# EAGLE design Apollo4-BluePlus-Module_rev_b_v6 (EAGLE 9.7.0)
AUTHOR: Pat Pannuto; REV: B; TITLE: Apollo4-BluePlus-Module

## Sheet 1 of 2: Apollo4 IC
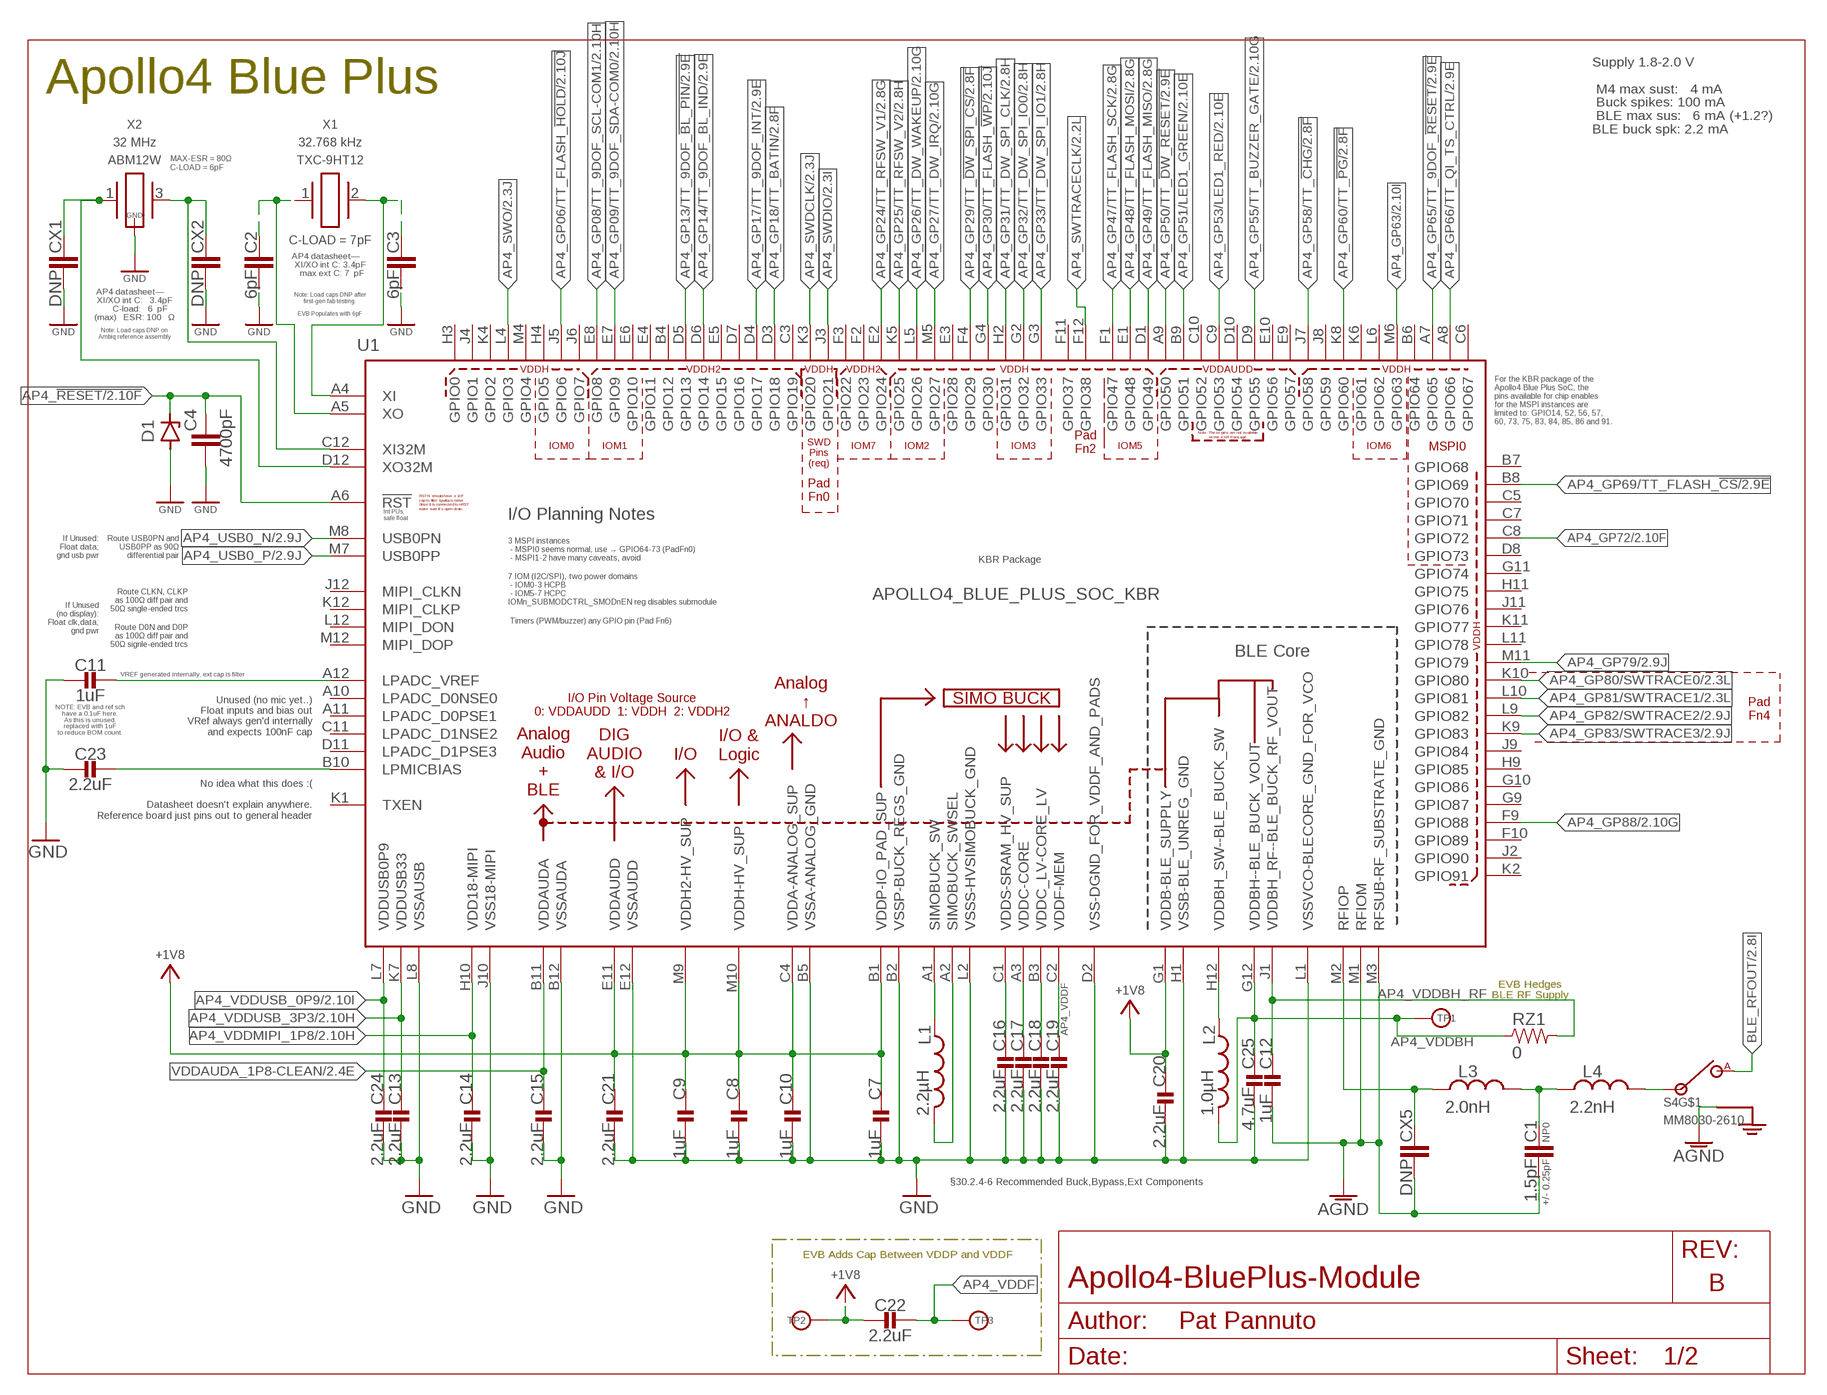
[diagram p0: schematic, sheet 1]

### Parts
C1  1.5pF  C_CHIP-0402(1005-METRIC)  [CAPC1005X60]
C2  6pF  C_CHIP-0402(1005-METRIC)  [CAPC1005X60]
C3  6pF  C_CHIP-0402(1005-METRIC)  [CAPC1005X60]
C4  4700pF  C_CHIP-0402(1005-METRIC)  [CAPC1005X60]
C7  1uF  CAPACITOR0201_CAP  [0201_CAP]
C8  1uF  CAPACITOR0201_CAP  [0201_CAP]
C9  1uF  CAPACITOR0201_CAP  [0201_CAP]
C10  1uF  CAPACITOR0201_CAP  [0201_CAP]
C11  1uF  CAPACITOR0201_CAP  [0201_CAP]
C12  1uF  CAPACITOR0201_CAP  [0201_CAP]
C13  2.2uF  CAPACITOR0201_CAP  [0201_CAP]
C14  2.2uF  CAPACITOR0201_CAP  [0201_CAP]
C15  2.2uF  CAPACITOR0201_CAP  [0201_CAP]
C16  2.2uF  CAPACITOR0201_CAP  [0201_CAP]
C17  2.2uF  CAPACITOR0201_CAP  [0201_CAP]
C18  2.2uF  CAPACITOR0201_CAP  [0201_CAP]
C19  2.2uF  CAPACITOR0201_CAP  [0201_CAP]
C20  2.2uF  CAPACITOR0201_CAP  [0201_CAP]
C21  2.2uF  CAPACITOR0201_CAP  [0201_CAP]
C22  2.2uF  CAPACITOR0201_CAP  [0201_CAP]
C23  2.2uF  CAPACITOR0201_CAP  [0201_CAP]
C24  2.2uF  CAPACITOR0201_CAP  [0201_CAP]
C25  4.7uF  CAPACITOR0402_CAP  [0402_CAP]
CX1  DNP  C_CHIP-0402(1005-METRIC)  [CAPC1005X60]
CX2  DNP  C_CHIP-0402(1005-METRIC)  [CAPC1005X60]
CX5  DNP  C_CHIP-0402(1005-METRIC)  [CAPC1005X60]
D1  ZENER  ZENER_SODFL(1608-METRIC)  [SODFL1608X70]
L1  2.2µH  INDUCTOR0805  [0805_CAP]
L2  1.0µH  INDUCTOR0603  [0603_CAP]
L3  2.0nH  L_CHIP-0402(1006-METRIC)  [INDC1006X60N]
L4  2.2nH  L_CHIP-0402(1006-METRIC)  [INDC1006X60N]
RZ1  0  RESISTOR0402_RES  [0402_RES]
S4  MM8030-2610  [MM8030-2610]
TP1  VDDBH  TEST-POINT  [PAD.03X.03]
TP2  VDDP  TEST-POINT  [PAD.03X.03]
TP3  VDDF  TEST-POINT  [PAD.03X.03]
U1  APOLLO4_BLUE_PLUS_SOC_KBR  [APOLLO4_BLUE_SOC_BGA]
X1  TXC-9HT12  [TXC-9HT12]
X2  ABM12W  [ABM12W]

### Nets
+1V8: C7.P$1 C8.P$1 C9.P$1 C10.P$1 C20.P$1 C21.P$1 C22.P$2 TP2.P$1(TESTPOINT) U1.B1(VDDP-IO_PAD_SUP) U1.C4(VDDA-ANALOG_SUP) U1.E11(VDDAUDD) U1.G1(VDDB-BLE_SUPPLY) U1.M9(VDDH2-HV_SUP) U1.M10(VDDH-HV_SUP) ; also sheet 2
AGND: C1.2 C12.P$2 CX5.2 S4.G1(GND) S4.G2(GND) U1.M1(RFIOM) U1.M3(RFSUB-RF_SUBSTRATE_GND) ; also sheet 2
AP4_!RESET: C4.1 D1.1(C) U1.A6(!RST) ; also sheet 2
AP4_GP06/TT_FLASH_!HOLD: U1.J5(GPIO6) ; also sheet 2
AP4_GP08/TT_9DOF_SCL-COM1: U1.E8(GPIO8) ; also sheet 2
AP4_GP09/TT_9DOF_SDA-COM0: U1.E7(GPIO9) ; also sheet 2
AP4_GP13/TT_9DOF_!BL_PIN: U1.D5(GPIO13) ; also sheet 2
AP4_GP14/TT_9DOF_BL_IND: U1.D6(GPIO14) ; also sheet 2
AP4_GP17/TT_9DOF_INT: U1.D4(GPIO17) ; also sheet 2
AP4_GP18/TT_BATIN: U1.D3(GPIO18) ; also sheet 2
AP4_GP24/TT_RFSW_V1: U1.E2(GPIO24) ; also sheet 2
AP4_GP25/TT_RFSW_V2: U1.K5(GPIO25) ; also sheet 2
AP4_GP26/TT_DW_WAKEUP: U1.L5(GPIO26) ; also sheet 2
AP4_GP27/TT_DW_IRQ: U1.M5(GPIO27) ; also sheet 2
AP4_GP29/TT_!DW_SPI_CS: U1.F4(GPIO29) ; also sheet 2
AP4_GP30/TT_FLASH_!WP: U1.G4(GPIO30) ; also sheet 2
AP4_GP31/TT_DW_SPI_CLK: U1.H2(GPIO31) ; also sheet 2
AP4_GP32/TT_DW_SPI_IO0: U1.G2(GPIO32) ; also sheet 2
AP4_GP33/TT_DW_SPI_IO1: U1.G3(GPIO33) ; also sheet 2
AP4_GP47/TT_FLASH_SCK: U1.F1(GPIO47) ; also sheet 2
AP4_GP48/TT_FLASH_MOSI: U1.E1(GPIO48) ; also sheet 2
AP4_GP49/TT_FLASH_MISO: U1.D1(GPIO49) ; also sheet 2
AP4_GP50/TT_!DW_RESET: U1.A9(GPIO50) ; also sheet 2
AP4_GP51/LED1_GREEN: U1.B9(GPIO51) ; also sheet 2
AP4_GP53/LED1_RED: U1.C9(GPIO53) ; also sheet 2
AP4_GP55/TT_BUZZER_GATE: U1.D9(GPIO55) ; also sheet 2
AP4_GP58/TT_!CHG: U1.J7(GPIO58) ; also sheet 2
AP4_GP60/TT_!PG: U1.K8(GPIO60) ; also sheet 2
AP4_GP63: U1.M6(GPIO63) ; also sheet 2
AP4_GP65/TT_9DOF_!RESET: U1.A7(GPIO65) ; also sheet 2
AP4_GP66/TT_QI_TS_CTRL: U1.A8(GPIO66) ; also sheet 2
AP4_GP69/TT_FLASH_!CS: U1.B8(GPIO69) ; also sheet 2
AP4_GP72: U1.C8(GPIO72) ; also sheet 2
AP4_GP79: U1.M11(GPIO79) ; also sheet 2
AP4_GP80/SWTRACE0: U1.K10(GPIO80) ; also sheet 2
AP4_GP81/SWTRACE1: U1.L10(GPIO81) ; also sheet 2
AP4_GP82/SWTRACE2: U1.L9(GPIO82) ; also sheet 2
AP4_GP83/SWTRACE3: U1.K9(GPIO83) ; also sheet 2
AP4_GP88: U1.F9(GPIO88) ; also sheet 2
AP4_LPADC_VREF: C11.P$2 U1.A12(LPADC_VREF)
AP4_LPMICBIAS: C23.P$2 U1.B10(LPMICBIAS)
AP4_RFIOP [BLE_PHY]: CX5.1 L3.1 U1.M2(RFIOP)
AP4_SWDCLK: U1.K3(GPIO20) ; also sheet 2
AP4_SWDIO: U1.J3(GPIO21) ; also sheet 2
AP4_SWO: U1.L4(GPIO3) ; also sheet 2
AP4_SWTRACECLK: U1.F12(GPIO38) ; also sheet 2
AP4_USB0_N [USB_PHY]: U1.M8(USB0PN) ; also sheet 2
AP4_USB0_P [USB_PHY]: U1.M7(USB0PP) ; also sheet 2
AP4_VDDBH: C25.1 L2.2 RZ1.1 TP1.P$1(TESTPOINT) U1.G12(VDDBH--BLE_BUCK_VOUT)
AP4_VDDBH_RF: C12.P$1 RZ1.2 U1.J1(VDDBH_RF--BLE_BUCK_RF_VOUT)
AP4_VDDBH_SW: L2.1 U1.H12(VDDBH_SW--BLE_BUCK_SW)
AP4_VDDC: C17.P$1 U1.A3(VDDC-CORE)
AP4_VDDC_LV: C18.P$1 U1.B3(VDDC_LV-CORE_LV)
AP4_VDDF: C19.P$1 C22.P$1 TP3.P$1(TESTPOINT) U1.C2(VDDF-MEM)
AP4_VDDMIPI_1P8: C14.P$1 U1.H10(VDD18-MIPI) ; also sheet 2
AP4_VDDS: C16.P$1 U1.C1(VDDS-SRAM_HV_SUP)
AP4_VDDUSB_0P9: C24.P$1 U1.L7(VDDUSB0P9) ; also sheet 2
AP4_VDDUSB_3P3: C13.P$1 U1.K7(VDDUSB33) ; also sheet 2
AP4_XI: C3.1 U1.A4(XI) X1.2
AP4_XI32M: CX2.1 U1.C12(XI32M) X2.3
AP4_XO: C2.1 U1.A5(XO) X1.1
AP4_XO32M: CX1.1 U1.D12(XO32M) X2.1
BLE_RFOUT [BLE_PHY]: S4.OUT(A) ; also sheet 2
GND: C2.2 C3.2 C4.2 C7.P$2 C8.P$2 C9.P$2 C10.P$2 C11.P$1 C13.P$2 C14.P$2 C15.P$2 C16.P$2 C17.P$2 C18.P$2 C19.P$2 C20.P$2 C21.P$2 C23.P$1 C24.P$2 C25.2 CX1.2 CX2.2 D1.2(A) U1.B2(VSSP-BUCK_REGS_GND) U1.B5(VSSA-ANALOG_GND) U1.B12(VSSAUDA) U1.D2(VSS-DGND_FOR_VDDF_AND_PADS) U1.E12(VSSAUDD) U1.H1(VSSB-BLE_UNREG_GND) U1.J10(VSS18-MIPI) U1.L1(VSSVCO-BLECORE_GND_FOR_VCO) U1.L2(VSSS-HVSIMOBUCK_GND) U1.L8(VSSAUSB) X2.2(GND) X2.4(GND) ; also sheet 2
N$17 [BLE_PHY]: C1.1 L3.2 L4.1
N$18 [BLE_PHY]: L4.2 S4.IN
SIMOBUCK_SW: L1.P$1 U1.A1(SIMOBUCK_SW)
SIMOBUCK_SWSEL: L1.P$2 U1.A2(SIMOBUCK_SWSEL)
VDDAUDA_1P8-CLEAN: C15.P$1 U1.B11(VDDAUDA) ; also sheet 2
Unconnected: U1.A10(LPADC_D0NSE0) U1.A11(LPADC_D0PSE1) U1.B4(GPIO12) U1.B6(GPIO64) U1.B7(GPIO68) U1.C3(GPIO19) U1.C5(GPIO70) U1.C6(GPIO67) U1.C7(GPIO71) U1.C10(GPIO52) U1.C11(LPADC_D1NSE2) U1.D7(GPIO16) U1.D8(GPIO73) U1.D10(GPIO54) U1.D11(LPADC_D1PSE3) U1.E3(GPIO28) U1.E4(GPIO11) U1.E5(GPIO15) U1.E6(GPIO10) U1.E9(GPIO57) U1.E10(GPIO56) U1.F2(GPIO23) U1.F3(GPIO22) U1.F10(GPIO89) U1.F11(GPIO37) U1.G9(GPIO87) U1.G10(GPIO86) U1.G11(GPIO74) U1.H3(GPIO0) U1.H4(GPIO5) U1.H9(GPIO85) U1.H11(GPIO75) U1.J2(GPIO90) U1.J4(GPIO1) U1.J6(GPIO7) U1.J8(GPIO59) U1.J9(GPIO84) U1.J11(GPIO76) U1.J12(MIPI_CLKN) U1.K1(TXEN) U1.K2(GPIO91) U1.K4(GPIO2) U1.K6(GPIO61) U1.K11(GPIO77) U1.K12(MIPI_CLKP) U1.L6(GPIO62) U1.L11(GPIO78) U1.L12(MIPI_DON) U1.M4(GPIO4) U1.M12(MIPI_DOP)

### Notes on the sheet
- Apollo4 Blue Plus
- Supply 1.8-2.0 V
  
   M4 max sust:   4 mA
   Buck spikes: 100 mA
   BLE max sus:   6 mA (+1.2?)
  BLE buck spk: 2.2 mA
- AP4 datasheet—    
  XI/XO int C: 3.4pF
    max ext C: 7  pF
- AP4 datasheet—    
  XI/XO int C:   3.4pF
       C-load:   6  pF
  (max)   ESR: 100   Ω
- Note: Load caps DNP after
  first-gen fab testing.
  
  EVB Populates with 6pF
- Note: Load caps DNP on
  Ambiq reference assembly
- For the KBR package of the
  Apollo4 Blue Plus SoC, the
  pins available for chip enables
  for the MSPI instances are
  limited to: GPIO14, 52, 56, 57,
  60, 73, 75, 83, 84, 85, 86 and 91.
- Pad
  Fn2
- MSPI0
- IOM0 | IOM1 | IOM7 | IOM2 | IOM3 | IOM5 | IOM6
- SWD
  Pins
  (req)
- Pad
  Fn0
- Int PUs,
  safe float
- I/O Planning Notes
- 3 MSPI instances
   - MSPI0 seems normal, use → GPIO64-73 (PadFn0)
   - MSPI1-2 have many caveats, avoid
- If Unused:
  Float data;
  gnd usb pwr
- Route USB0PN and
  USB0PP as 90Ω
  differential pair
- KBR Package
- 7 IOM (I2C/SPI), two power domains
   - IOM0-3 HCPB
   - IOM5-7 HCPC
  IOMn_SUBMODCTRL_SMODnEN reg disables submodule
- Route CLKN, CLKP
  as 100Ω diff pair and
  50Ω single-ended trcs
- If Unused
  (no display):
  Float clk,data;
  gnd pwr
- Timers (PWM/buzzer) any GPIO pin (Pad Fn6)
- Route D0N and D0P
  as 100Ω diff pair and
  50Ω signle-ended trcs
- VREF generated internally, ext cap is filter
- NOTE: EVB and ref sch
  have a 0.1uF here.
  As this is unused,
  replaced with 1uF
  to reduce BOM count.
- Pad
  Fn4
- Unused (no mic yet..)
  Float inputs and bias out
  VRef always gen'd internally
  and expects 100nF cap
- No idea what this does :(
  
  Datasheet doesn't explain anywhere.
  Reference board just pins out to general header
- EVB Hedges
  BLE RF Supply
- §30.2.4-6 Recommended Buck,Bypass,Ext Components
- EVB Adds Cap Between VDDP and VDDF

## Sheet 2 of 2: Support Circuits
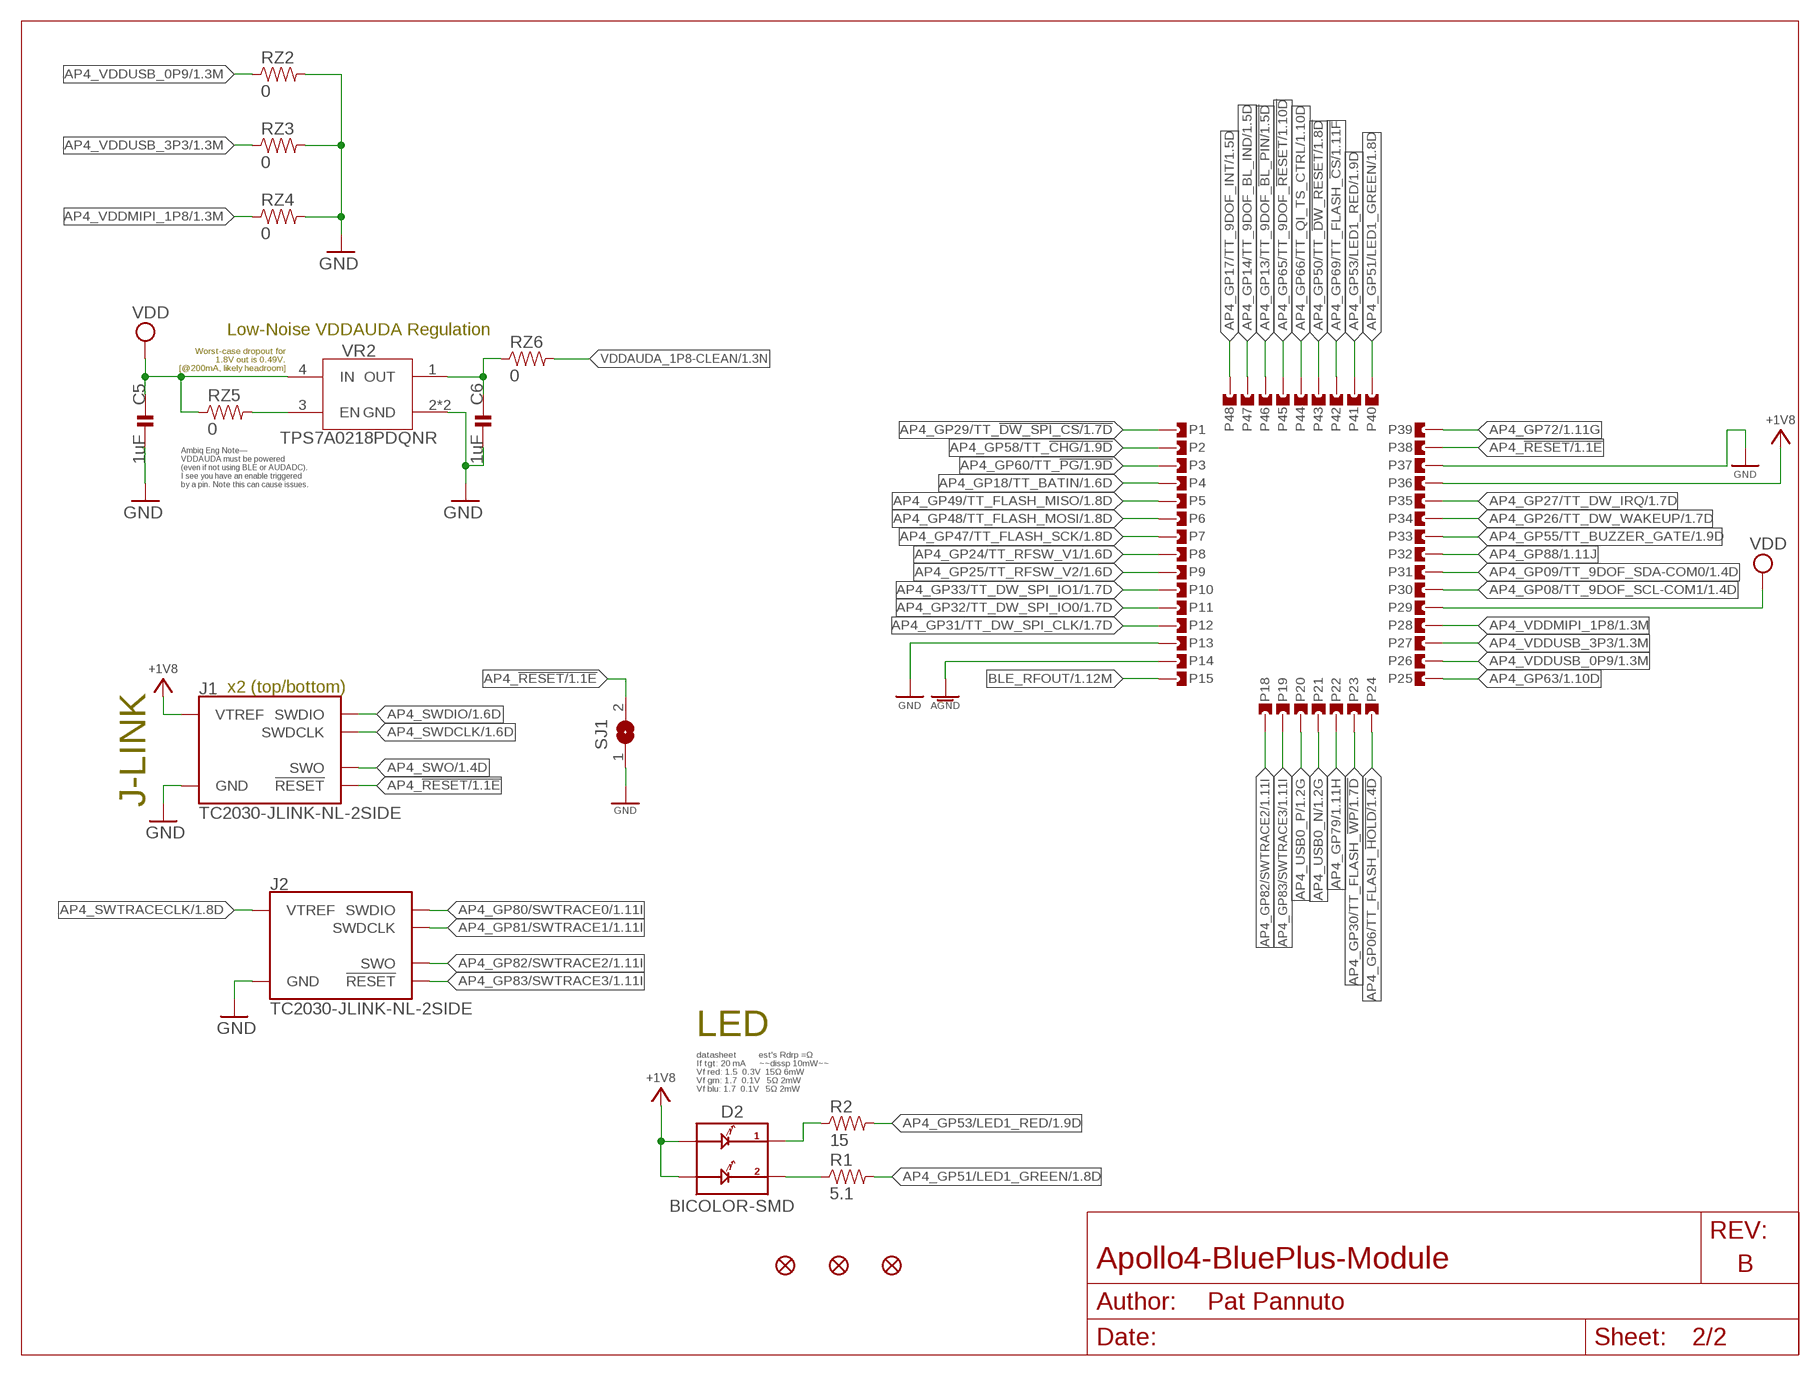
[diagram p1: schematic, sheet 2]

### Parts
C5  1uF  CAPACITOR0201_CAP  [0201_CAP]
C6  1uF  CAPACITOR0201_CAP  [0201_CAP]
D2  BICOLOR-SMD  [LED-0606]
FD1  FIDUCIALUFIDUCIAL  [FIDUCIAL-MICRO]
FD2  FIDUCIALUFIDUCIAL  [FIDUCIAL-MICRO]
FD3  FIDUCIALUFIDUCIAL  [FIDUCIAL-MICRO]
J1  TC2030-JLINK-NL-2SIDE  [TC2030-IDC-NL-2SIDE]
J2  TC2030-JLINK-NL-2SIDE  [TC2030-IDC-NL-2SIDE]
P1  CASTELLATION4L  [CASTELLATION-0.55MM_DRILL-4L]
P2  CASTELLATION4L  [CASTELLATION-0.55MM_DRILL-4L]
P3  CASTELLATION4L  [CASTELLATION-0.55MM_DRILL-4L]
P4  CASTELLATION4L  [CASTELLATION-0.55MM_DRILL-4L]
P5  CASTELLATION4L  [CASTELLATION-0.55MM_DRILL-4L]
P6  CASTELLATION4L  [CASTELLATION-0.55MM_DRILL-4L]
P7  CASTELLATION4L  [CASTELLATION-0.55MM_DRILL-4L]
P8  CASTELLATION4L  [CASTELLATION-0.55MM_DRILL-4L]
P9  CASTELLATION4L  [CASTELLATION-0.55MM_DRILL-4L]
P10  CASTELLATION4L  [CASTELLATION-0.55MM_DRILL-4L]
P11  CASTELLATION4L  [CASTELLATION-0.55MM_DRILL-4L]
P12  CASTELLATION4L  [CASTELLATION-0.55MM_DRILL-4L]
P13  CASTELLATION4L  [CASTELLATION-0.55MM_DRILL-4L]
P14  CASTELLATION4L  [CASTELLATION-0.55MM_DRILL-4L]
P15  CASTELLATION4L  [CASTELLATION-0.55MM_DRILL-4L]
P18  CASTELLATION4L  [CASTELLATION-0.55MM_DRILL-4L]
P19  CASTELLATION4L  [CASTELLATION-0.55MM_DRILL-4L]
P20  CASTELLATION4L  [CASTELLATION-0.55MM_DRILL-4L]
P21  CASTELLATION4L  [CASTELLATION-0.55MM_DRILL-4L]
P22  CASTELLATION4L  [CASTELLATION-0.55MM_DRILL-4L]
P23  CASTELLATION4L  [CASTELLATION-0.55MM_DRILL-4L]
P24  CASTELLATION4L  [CASTELLATION-0.55MM_DRILL-4L]
P25  CASTELLATION4L  [CASTELLATION-0.55MM_DRILL-4L]
P26  CASTELLATION4L  [CASTELLATION-0.55MM_DRILL-4L]
P27  CASTELLATION4L  [CASTELLATION-0.55MM_DRILL-4L]
P28  CASTELLATION4L  [CASTELLATION-0.55MM_DRILL-4L]
P29  CASTELLATION4L  [CASTELLATION-0.55MM_DRILL-4L]
P30  CASTELLATION4L  [CASTELLATION-0.55MM_DRILL-4L]
P31  CASTELLATION4L  [CASTELLATION-0.55MM_DRILL-4L]
P32  CASTELLATION4L  [CASTELLATION-0.55MM_DRILL-4L]
P33  CASTELLATION4L  [CASTELLATION-0.55MM_DRILL-4L]
P34  CASTELLATION4L  [CASTELLATION-0.55MM_DRILL-4L]
P35  CASTELLATION4L  [CASTELLATION-0.55MM_DRILL-4L]
P36  CASTELLATION4L  [CASTELLATION-0.55MM_DRILL-4L]
P37  CASTELLATION4L  [CASTELLATION-0.55MM_DRILL-4L]
P38  CASTELLATION4L  [CASTELLATION-0.55MM_DRILL-4L]
P39  CASTELLATION4L  [CASTELLATION-0.55MM_DRILL-4L]
P40  CASTELLATION4L  [CASTELLATION-0.55MM_DRILL-4L]
P41  CASTELLATION4L  [CASTELLATION-0.55MM_DRILL-4L]
P42  CASTELLATION4L  [CASTELLATION-0.55MM_DRILL-4L]
P43  CASTELLATION4L  [CASTELLATION-0.55MM_DRILL-4L]
P44  CASTELLATION4L  [CASTELLATION-0.55MM_DRILL-4L]
P45  CASTELLATION4L  [CASTELLATION-0.55MM_DRILL-4L]
P46  CASTELLATION4L  [CASTELLATION-0.55MM_DRILL-4L]
P47  CASTELLATION4L  [CASTELLATION-0.55MM_DRILL-4L]
P48  CASTELLATION4L  [CASTELLATION-0.55MM_DRILL-4L]
R1  5.1  RESISTOR0201_RES  [0201_RES]
R2  15  RESISTOR0201_RES  [0201_RES]
RZ2  0  RESISTOR0402_RES  [0402_RES]
RZ3  0  RESISTOR0402_RES  [0402_RES]
RZ4  0  RESISTOR0402_RES  [0402_RES]
RZ5  0  RESISTOR0402_RES  [0402_RES]
RZ6  0  RESISTOR0402_RES  [0402_RES]
SJ1  SJ  [SJ]
VR2  TPS7A0218PDQNR  [4-XDFN-EP]

### Nets
+1V8: D2.A1 D2.A2 J1.1(VTREF) J1.B1(VTREF) P36.P$1 P36.P$2 P36.P$3 ; also sheet 1
AGND: P14.P$1 P14.P$2 P14.P$3 ; also sheet 1
AP4_!RESET: J1.3(!RESET) J1.B3(!RESET) P38.P$1 P38.P$2 P38.P$3 SJ1.2 ; also sheet 1
AP4_GP06/TT_FLASH_!HOLD: P24.P$1 P24.P$2 P24.P$3 ; also sheet 1
AP4_GP08/TT_9DOF_SCL-COM1: P30.P$1 P30.P$2 P30.P$3 ; also sheet 1
AP4_GP09/TT_9DOF_SDA-COM0: P31.P$1 P31.P$2 P31.P$3 ; also sheet 1
AP4_GP13/TT_9DOF_!BL_PIN: P46.P$1 P46.P$2 P46.P$3 ; also sheet 1
AP4_GP14/TT_9DOF_BL_IND: P47.P$1 P47.P$2 P47.P$3 ; also sheet 1
AP4_GP17/TT_9DOF_INT: P48.P$1 P48.P$2 P48.P$3 ; also sheet 1
AP4_GP18/TT_BATIN: P4.P$1 P4.P$2 P4.P$3 ; also sheet 1
AP4_GP24/TT_RFSW_V1: P8.P$1 P8.P$2 P8.P$3 ; also sheet 1
AP4_GP25/TT_RFSW_V2: P9.P$1 P9.P$2 P9.P$3 ; also sheet 1
AP4_GP26/TT_DW_WAKEUP: P34.P$1 P34.P$2 P34.P$3 ; also sheet 1
AP4_GP27/TT_DW_IRQ: P35.P$1 P35.P$2 P35.P$3 ; also sheet 1
AP4_GP29/TT_!DW_SPI_CS: P1.P$1 P1.P$2 P1.P$3 ; also sheet 1
AP4_GP30/TT_FLASH_!WP: P23.P$1 P23.P$2 P23.P$3 ; also sheet 1
AP4_GP31/TT_DW_SPI_CLK: P12.P$1 P12.P$2 P12.P$3 ; also sheet 1
AP4_GP32/TT_DW_SPI_IO0: P11.P$1 P11.P$2 P11.P$3 ; also sheet 1
AP4_GP33/TT_DW_SPI_IO1: P10.P$1 P10.P$2 P10.P$3 ; also sheet 1
AP4_GP47/TT_FLASH_SCK: P7.P$1 P7.P$2 P7.P$3 ; also sheet 1
AP4_GP48/TT_FLASH_MOSI: P6.P$1 P6.P$2 P6.P$3 ; also sheet 1
AP4_GP49/TT_FLASH_MISO: P5.P$1 P5.P$2 P5.P$3 ; also sheet 1
AP4_GP50/TT_!DW_RESET: P43.P$1 P43.P$2 P43.P$3 ; also sheet 1
AP4_GP51/LED1_GREEN: P40.P$1 P40.P$2 P40.P$3 R1.2 ; also sheet 1
AP4_GP53/LED1_RED: P41.P$1 P41.P$2 P41.P$3 R2.2 ; also sheet 1
AP4_GP55/TT_BUZZER_GATE: P33.P$1 P33.P$2 P33.P$3 ; also sheet 1
AP4_GP58/TT_!CHG: P2.P$1 P2.P$2 P2.P$3 ; also sheet 1
AP4_GP60/TT_!PG: P3.P$1 P3.P$2 P3.P$3 ; also sheet 1
AP4_GP63: P25.P$1 P25.P$2 P25.P$3 ; also sheet 1
AP4_GP65/TT_9DOF_!RESET: P45.P$1 P45.P$2 P45.P$3 ; also sheet 1
AP4_GP66/TT_QI_TS_CTRL: P44.P$1 P44.P$2 P44.P$3 ; also sheet 1
AP4_GP69/TT_FLASH_!CS: P42.P$1 P42.P$2 P42.P$3 ; also sheet 1
AP4_GP72: P39.P$1 P39.P$2 P39.P$3 ; also sheet 1
AP4_GP79: P22.P$1 P22.P$2 P22.P$3 ; also sheet 1
AP4_GP80/SWTRACE0: J2.2(SWDIO) J2.B2(SWDIO) ; also sheet 1
AP4_GP81/SWTRACE1: J2.4(SWDCLK) J2.B4(SWDCLK) ; also sheet 1
AP4_GP82/SWTRACE2: J2.6(SWO) J2.B6(SWO) P18.P$1 P18.P$2 P18.P$3 ; also sheet 1
AP4_GP83/SWTRACE3: J2.3(!RESET) J2.B3(!RESET) P19.P$1 P19.P$2 P19.P$3 ; also sheet 1
AP4_GP88: P32.P$1 P32.P$2 P32.P$3 ; also sheet 1
AP4_LED2_BLUE_COMM: D2.C1 R2.1
AP4_LED_RED_COMM: D2.C2 R1.1
AP4_SWDCLK: J1.4(SWDCLK) J1.B4(SWDCLK) ; also sheet 1
AP4_SWDIO: J1.2(SWDIO) J1.B2(SWDIO) ; also sheet 1
AP4_SWO: J1.6(SWO) J1.B6(SWO) ; also sheet 1
AP4_SWTRACECLK: J2.1(VTREF) J2.B1(VTREF) ; also sheet 1
AP4_USB0_N [USB_PHY]: P21.P$1 P21.P$2 P21.P$3 ; also sheet 1
AP4_USB0_P [USB_PHY]: P20.P$1 P20.P$2 P20.P$3 ; also sheet 1
AP4_VDDMIPI_1P8: P28.P$1 P28.P$2 P28.P$3 RZ4.1 ; also sheet 1
AP4_VDDUSB_0P9: P26.P$1 P26.P$2 P26.P$3 RZ2.1 ; also sheet 1
AP4_VDDUSB_3P3: P27.P$1 P27.P$2 P27.P$3 RZ3.1 ; also sheet 1
BLE_RFOUT [BLE_PHY]: P15.P$1 P15.P$2 P15.P$3 ; also sheet 1
GND: C5.P$2 C6.P$2 J1.5(GND) J1.B5(GND) J2.5(GND) J2.B5(GND) P13.P$1 P13.P$2 P13.P$3 P37.P$1 P37.P$2 P37.P$3 RZ2.2 RZ3.2 RZ4.2 SJ1.1 VR2.2(GND) VR2.PAD(GND) ; also sheet 1
VDD: C5.P$1 P29.P$1 P29.P$2 P29.P$3 RZ5.1 VR2.4(IN)
VDDAUDA_1P8-CLEAN: RZ6.2 ; also sheet 1
VR2_EN: RZ5.2 VR2.3(EN)
VR2_OUT: C6.P$1 RZ6.1 VR2.1(OUT)

### Notes on the sheet
- Low-Noise VDDAUDA Regulation
- Worst-case dropout for
  1.8V out is 0.49V.
  [@200mA, likely headroom]
- Ambiq Eng Note—
  VDDAUDA must be powered
  (even if not using BLE or AUDADC).
  I see you have an enable triggered
  by a pin. Note this can cause issues.
- x2 (top/bottom)
- J-LINK
- LED
- datasheet          est's Rdrp =Ω
  If tgt: 20 mA      ~~dissp 10mW~~
  Vf red: 1.5  0.3V  15Ω 6mW
  Vf grn: 1.7  0.1V   5Ω 2mW
  Vf blu: 1.7  0.1V   5Ω 2mW

## Library data of the parts
C1 = Capacitor:C: Capacitor - Generic; CATEGORY: Capacitor; DESCRIPTION: CAP CER 1.5PF 50V C0G/NP0 0402; MANUFACTURER: KEMET; MPN: C0402C159C5GAC7867; TEMPCOEFF: NP0; TOLERANCE: +/- 0.25pF
C2 C3 = Capacitor:C: Capacitor - Generic; CATEGORY: Capacitor; MANUFACTURER: Murata; MPN: GCM1555C1H6R0BA16D
C4 = Capacitor:C: Capacitor - Generic; CATEGORY: Capacitor; MPN: KGM05AR71E472KH
C5-C10 C12 = passives:CAPACITOR: SMD Capacitor; MANUFACTURER: Murata; MPN: GRM033R61A105ME44D
C11 = passives:CAPACITOR: SMD Capacitor; MANUFACTURER: MURATA; MPN: GRM033R61A105ME44D
C13-C24 = passives:CAPACITOR: SMD Capacitor; MANUFACTURER: Murata; MPN: GRM033R61A225KE47D
C25 = passives:CAPACITOR: SMD Capacitor; MPN: CL05A475MP5NRNC
CX1 CX2 CX5 = Capacitor:C: Capacitor - Generic; CATEGORY: Capacitor
D1 = Diode:ZENER: Zener Diode - Generic; CATEGORY: Diode; DESCRIPTION: DIODE TVS 5.5V STANDOFF 8V BREAKDOWN SC79; MANUFACTURER: NXP SEMICONDUCTOR; MPN: PESD5V0X1UB,135; SUB-CATEGORY: Zener
D2 = leds:BICOLOR-SMD; MPN: MCL0606FRD1GR1T
FD1-FD3 = SparkFun-Aesthetics:FIDUCIAL: Fiducial Alignment Points Point-of-reference for pick-and-place machines and other optical instruments.
J1 J2 = connector:TC2030-JLINK
L1 = passives:INDUCTOR: A very specific inductor; MANUFACTURER: Murata; MPN: DFE201210U-2R2M=P2
L2 = passives:INDUCTOR: A very specific inductor; MANUFACTURER: Murata; MPN: DFE18SAN1R0ME0L
L3 = Inductor:L: Inductor Fixed - Generic; CATEGORY: Inductor; DESCRIPTION: FIXED IND 2.0NH0.1NH SMD; MANUFACTURER: Central Technologies; MPN: CTTF0402F-2N0B; SUB-CATEGORY: Fixed; TOLERANCE: +/- 0.1 nH
L4 = Inductor:L: Inductor Fixed - Generic; CATEGORY: Inductor; DESCRIPTION: FIXED IND 2.2NH0.1NH SMD; MANUFACTURER: Central Technologies; MPN: CTTF0402F-2N2B; SUB-CATEGORY: Fixed; TOLERANCE: +/- 0.1 nH
P1-P15 P18-P48 = connector:CASTELLATION: Castellation 0.55 mm drill, 1.27 mm pitch – Matches ESP32
R1 = passives:RESISTOR: Resistor Basic schematic elements and footprints for 0201, 0402, 0603, 1206, and PTH resistors.; MPN: SR731HTTC5R10F; PDISS: 0.002 W
R2 = passives:RESISTOR: Resistor Basic schematic elements and footprints for 0201, 0402, 0603, 1206, and PTH resistors.; DESCRIPTION: RES SMD 15 OHM 5% 1/20W 0201; MPN: ERJ-1GNJ150C; PDISS: 0.006 W
RZ1-RZ6 = passives:RESISTOR: Resistor Basic schematic elements and footprints for 0201, 0402, 0603, 1206, and PTH resistors.; MPN: RMCF0402ZT0R00; SUBSTITUE: Any
S4 = switches:MM8030-2610; DURABILITY: 100 Cycles; FREQ-MAX: 11 GHz; MANUFACTURER: Murata; MPN: MM8030-2610
SJ1 = jumper:SJ: SMD solder JUMPER
TP1-TP3 = headers:TEST-POINT
U1 = Quorvo:APOLLO4_BLUE_PLUS_SOC_KBR; DESCRIPTION: IC - SoC Cortex-M4 and BLE Radio with M0, 4.7x4.7mm 131-pin BGA; MANUFACTURER: Ambiq; MPN: AMA4B2KP-KBR
VR2 = regulators:TPS7A02; MPN: TPS7A0218PDQNR
X1 = crystals:TXC-9HT12; C-LOAD: 7pF; FREQUENCY: 32.768 kHz; MANUFACTURER: TXC Corp; MPN: 9HT12-32.768KDZY-T
X2 = crystals:ABM12W; C-LOAD: 6pF; FREQUENCY: 32 MHz; MANUFACTURER: Abracon; MAX-ESR: 80Ω; MPN: ABM12W-32.0000MHZ-6-D1X-T3

## Net classes
1 USB_PHY: width 0.152 mm, clearance 0.305 mm
2 BLE_PHY: width 0.203 mm, clearance 0.095 mm

## Board
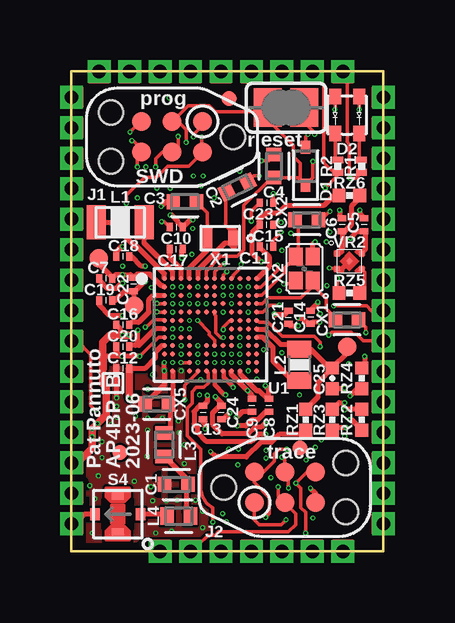
[diagram p2: board, top side]
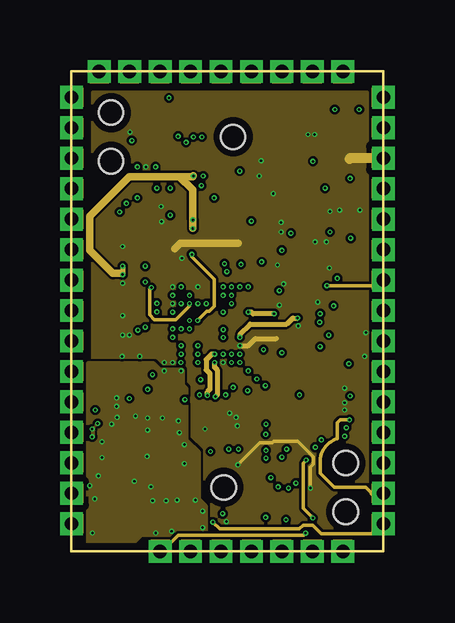
[diagram p3: board, inner layer Route2]
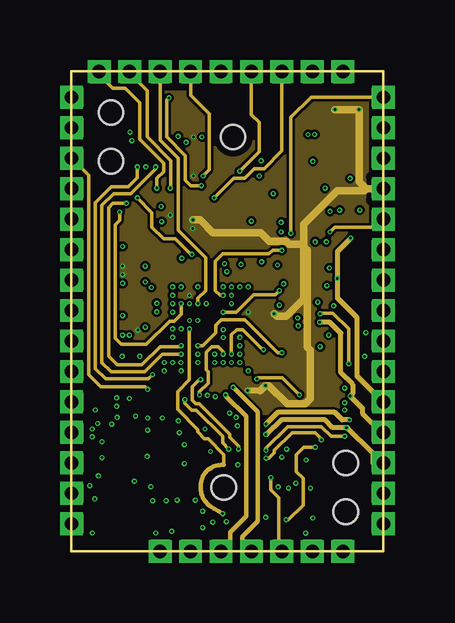
[diagram p4: board, inner layer Route15]
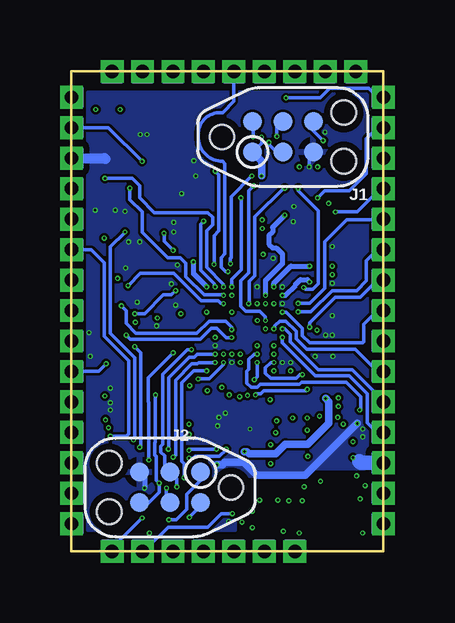
[diagram p5: board, bottom side, seen from below]

Size 13 x 20 mm. Coordinates in mm from the lower left corner, seen from the top.
Outline: 0,0 13,0 13,20 0,20 0,0
Copper layers (1+2*15+16): Top 0.035mm / dielectric 1.5mm / Route2 0.035mm / dielectric 0.15mm / Route15 0.035mm / dielectric 0.2mm / Bottom 0.035mm
Design rules "default *": minimum track width 6mil, minimum drill 4mil, track to track 4mil, track to pad 4mil, pad to pad 4mil, via to via 5mil, smd to smd 4mil, copper to edge 12mil, drill to drill 6mil, minimum pad ring 8mil, minimum via ring 2mil, stop-mask expansion 4mil, vias tented up to drill 0mil, thermal gap 10mil

### Footprints (pad centres in the part's own frame; a part is rotated, then mirrored left to right if it is on the bottom)
CAPC1005X60 = smd 0.56 x 0.629: 1 -0.485,0; 2 0.485,0
0201_CAP = smd 0.25 x 0.35: P$1 -0.275,0; P$2 0.275,0
0402_CAP = smd 0.536 x 0.546: 1 -0.433,0; 2 0.433,0
SODFL1608X70 = smd 0.538 x 0.4: 1 -0.796,0; 2 0.796,0
LED-0606 = smd 0.65 x 0.5: A1 0.775,0.5; A2 0.775,-0.5; C1 -0.775,0.5; C2 -0.775,-0.5
FIDUCIAL-MICRO = smd 0.635 x 0.635: 1 0,0
TC2030-IDC-NL-2SIDE = smd 0.787 x 0.787: 1 -1.27,-0.635; 2 -1.27,0.635; 3 0,-0.635; 4 0,0.635; 5 1.27,-0.635; 6 1.27,0.635 | smd 0.787 x 0.787 bottom: B1 -1.27,0.635; B2 -1.27,-0.635; B3 0,0.635; B4 0,-0.635; B5 1.27,0.635; B6 1.27,-0.635 | hole 1.016: -2.54,0; 2.54,1.016; 2.54,-1.016
0805_CAP = smd 0.8 x 1.4: P$1 1,0; P$2 -1,0
0603_CAP = smd 0.7 x 1: 1 -0.65,0; 2 0.65,0
INDC1006X60N = smd 0.56 x 0.729: 1 -0.485,0; 2 0.485,0
CASTELLATION-0.55MM_DRILL-4L = drill 0.55 pad 0.9 square: P$1 0,0 | smd 0.5 x 0.9: P$2 0.25,0 | smd 0.5 x 0.9 bottom: P$3 0.25,0
0201_RES = smd 0.28 x 0.43: 1 -0.255,0; 2 0.255,0
0402_RES = smd 0.536 x 0.546: 1 -0.433,0; 2 0.433,0
MM8030-2610 = smd 0.4 x 0.5: G1 -0.8,0; G2 0.8,0 | smd 0.5 x 0.4: IN 0,0.95; OUT 0,-0.95
SJ = smd 1.168 x 1.6: 1 -0.762,0; 2 0.762,0
PAD.03X.03 = smd 0.762 x 0.762: P$1 0,0
APOLLO4_BLUE_SOC_BGA = smd 0.2 x 0.2: A1 -1.925,1.925; A2 -1.575,1.925; A3 -1.225,1.925; A4 -0.875,1.925; A5 -0.525,1.925; A6 -0.175,1.925; A7 0.175,1.925; A8 0.525,1.925; A9 0.875,1.925; A10 1.225,1.925; A11 1.575,1.925; A12 1.925,1.925; B1 -1.925,1.575; B2 -1.575,1.575; B3 -1.225,1.575; B4 -0.875,1.575; B5 -0.525,1.575; B6 -0.175,1.575; B7 0.175,1.575; B8 0.525,1.575; B9 0.875,1.575; B10 1.225,1.575; B11 1.575,1.575; B12 1.925,1.575; C1 -1.925,1.225; C2 -1.575,1.225; C3 -1.225,1.225; C4 -0.875,1.225; C5 -0.525,1.225; C6 -0.175,1.225; C7 0.175,1.225; C8 0.525,1.225; C9 0.875,1.225; C10 1.225,1.225; C11 1.575,1.225; C12 1.925,1.225; D1 -1.925,0.875; D2 -1.575,0.875; D3 -1.225,0.875; D4 -0.875,0.875; D5 -0.525,0.875; D6 -0.175,0.875; D7 0.175,0.875; D8 0.525,0.875; D9 0.875,0.875; D10 1.225,0.875; D11 1.575,0.875; D12 1.925,0.875; E1 -1.925,0.525; E2 -1.575,0.525; E3 -1.225,0.525; E4 -0.875,0.525; E5 -0.525,0.525; E6 -0.175,0.525; E7 0.175,0.525; E8 0.525,0.525; E9 0.875,0.525; E10 1.225,0.525; E11 1.575,0.525; E12 1.925,0.525; F1 -1.925,0.175; F2 -1.575,0.175; F3 -1.225,0.175; F4 -0.875,0.175; F9 0.875,0.175; F10 1.225,0.175; F11 1.575,0.175; F12 1.925,0.175; G1 -1.925,-0.175; G2 -1.575,-0.175; G3 -1.225,-0.175; G4 -0.875,-0.175; G9 0.875,-0.175; G10 1.225,-0.175; G11 1.575,-0.175; G12 1.925,-0.175; H1 -1.925,-0.525; H2 -1.575,-0.525; H3 -1.225,-0.525; H4 -0.875,-0.525; H9 0.875,-0.525; H10 1.225,-0.525; H11 1.575,-0.525; H12 1.925,-0.525; J1 -1.925,-0.875; J2 -1.575,-0.875; J3 -1.225,-0.875; J4 -0.875,-0.875; J5 -0.525,-0.875; J6 -0.175,-0.875; J7 0.175,-0.875; J8 0.525,-0.875; J9 0.875,-0.875; J10 1.225,-0.875; J11 1.575,-0.875; J12 1.925,-0.875; K1 -1.925,-1.225; K2 -1.575,-1.225; K3 -1.225,-1.225; K4 -0.875,-1.225; K5 -0.525,-1.225; K6 -0.175,-1.225; K7 0.175,-1.225; K8 0.525,-1.225; K9 0.875,-1.225; K10 1.225,-1.225; K11 1.575,-1.225; K12 1.925,-1.225; L1 -1.925,-1.575; L2 -1.575,-1.575; L4 -0.875,-1.575; L5 -0.525,-1.575; L6 -0.175,-1.575; L7 0.175,-1.575; L8 0.525,-1.575; L9 0.875,-1.575; L10 1.225,-1.575; L11 1.575,-1.575; L12 1.925,-1.575; M1 -1.925,-1.925; M2 -1.575,-1.925; M3 -1.225,-1.925; M4 -0.875,-1.925; M5 -0.525,-1.925; M6 -0.175,-1.925; M7 0.175,-1.925; M8 0.525,-1.925; M9 0.875,-1.925; M10 1.225,-1.925; M11 1.575,-1.925; M12 1.925,-1.925
4-XDFN-EP = smd 0.21 x 0.21: 1 -0.505,0.325; 2 -0.505,-0.325; 3 0.505,-0.325; 4 0.505,0.325 | smd 0.2 x 0.2 rotated 45: PAD 0,0
TXC-9HT12 = smd 0.4 x 0.6: 1 -0.53,0 | smd 0.4 x 0.86: 2 0.53,0
ABM12W = smd 0.73 x 0.58: 1 -0.5,-0.35; 2 0.5,-0.35; 3 0.5,0.35; 4 -0.5,0.35

### Placement (x,y rotation side)
C1  4.37,2.79 180 top
C2  6.91,15.19 26 top
C3  4.72,14.58 180 top
C4  8.43,16.06 90 top
C5  12.19,13.61 90 top
C6  11.28,13.61 90 top
C7  1.42,11.38 180 top
C8  8.23,6.1 270 top
C9  7.52,6.1 270 top
C10  4.37,13.51 180 top
C11  8.13,12.7 180 top
C12  2.13,7.62 180 top
C13  5.49,5.79 270 top
C14  9.96,9.75 90 top
C15  8.13,13.61 0 top
C16  2.13,9.45 180 top
C17  4.37,12.6 0 top
C18  2.13,12.29 180 top
C19  1.42,10.46 180 top
C20  2.13,8.53 180 top
C21  9.04,9.75 270 top
C22  2.59,11.13 90 top
C23  8.13,14.53 180 top
C24  6.25,5.79 270 top
C25  10.87,7.21 270 top
CX1  11.48,9.65 0 top
CX2  9.8,13.82 0 top
CX5  3.56,6.15 180 top
D1  9.75,16.05 90 top
D2  11.48,18.19 90 top
FD1  2.03,4.12 0 top
FD2  9.52,4.31 0 top
FD3  6.57,18.87 0 top
J1  4.19,17.27 180 top
J2  8.89,2.67 0 top
L1  2.03,13.72 180 top
L2  9.5,7.77 90 top
L3  3.86,4.45 270 top
L4  4.47,1.47 180 top
P1  0,18.93 0 top
P2  0,17.66 0 top
P3  0,16.39 0 top
P4  0,15.12 0 top
P5  0,13.85 0 top
P6  0,12.58 0 top
P7  0,11.31 0 top
P8  0,10.04 0 top
P9  0,8.77 0 top
P10  0,7.5 0 top
P11  0,6.23 0 top
P12  0,4.96 0 top
P13  0,3.69 0 top
P14  0,2.42 0 top
P15  0,1.15 0 top
P18  3.69,0 90 top
P19  4.96,0 90 top
P20  6.23,0 90 top
P21  7.5,0 90 top
P22  8.77,0 90 top
P23  10.04,0 90 top
P24  11.31,0 90 top
P25  13,1.15 180 top
P26  13,2.42 180 top
P27  13,3.69 180 top
P28  13,4.96 180 top
P29  13,6.23 180 top
P30  13,7.5 180 top
P31  13,8.77 180 top
P32  13,10.04 180 top
P33  13,11.31 180 top
P34  13,12.58 180 top
P35  13,13.85 180 top
P36  13,15.12 180 top
P37  13,16.39 180 top
P38  13,17.66 180 top
P39  13,18.93 180 top
P40  11.31,20 270 top
P41  10.04,20 270 top
P42  8.77,20 270 top
P43  7.5,20 270 top
P44  6.23,20 270 top
P45  4.96,20 270 top
P46  3.69,20 270 top
P47  2.42,20 270 top
P48  1.15,20 270 top
R1  12.09,16.05 270 top
R2  11.1,16.05 270 top
RZ1  9.75,5.49 270 top
RZ2  12.09,5.49 90 top
RZ3  10.87,5.49 90 top
RZ4  12.09,7.21 90 top
RZ5  11.58,10.77 0 top
RZ6  11.58,14.83 180 top
S4  1.93,1.56 270 top
SJ1  8.94,18.49 180 top
TP1  11.48,8.53 0 top
TP2  1.13,12.23 0 top
TP3  2.62,10.24 0 top
U1  5.79,9.45 0 top
VR2  11.58,12.09 0 top
X1  6.2,13.06 180 top
X2  9.7,11.79 90 top

### Tracks (layer width: path | path; a pad name or v marks a point on that pad's centre or on a via)
+1V8  (via drill 0.1)
  Top 0.152: P36.P$3 P36.P$1 | J1.1 5.46,17.75 5.08,17.37 v5.08,17.27 | D2.A1 10.98,18.42 v10.97,18.41 | D2.A2 11.98,18.42 v11.99,18.41
  Top 0.203: v8.45,9.91 8.5,9.86 8.87,9.86 C21.P$1 | U1.M10 7.02,7.41 7.72,6.71 7.82,6.71 8.15,6.38 8.15,6.37 C8.P$1 8.23,6.76 v8.08,6.91 | U1.M9 6.67,7.38 v7.34,6.7 7.52,6.52 C9.P$1 | U1.B1 3.84,11.05 3.81,11.05 3.79,11.07 3.73,11.07 3.25,11.56 2.75,11.56 C22.P$2 2.46,11.53 v2.13,11.53 1.85,11.53 C7.P$1 1.7,11.43 1.13,12 TP2.P$1 | v5.05,13.82 4.95,13.82 C10.P$1 4.42,13.74 4.42,13.79 4.19,14.01 v4.12,14.01 | v2.77,9.22 2.77,8.69 2.66,8.59 | 2.66,8.59 2.81,8.59 3.49,9.27 U1.G1 | 2.66,8.59 2.46,8.59 C20.P$1
  Route2 0.152: v5.05,13.46 | v2.13,11.53 2.06,11.58
  Route2 0.203: v8.45,9.91 8.44,9.9 7.57,9.9 7.49,9.97 U1.E11 | v2.13,11.89 v2.13,11.53
  Route2 0.305: 4.5,15.62 5.05,15.06 v5.05,13.82 v5.05,13.46 | 4.5,15.62 2.41,15.62 0.76,13.97 0.76,12.55 1.73,11.58 2.06,11.58 | v5.08,15.65 5.05,15.62 4.5,15.62
  Route15 0.254: 7.87,6.7 v7.34,6.7
  Route15 0.305: 9.68,12.42 9.83,12.57 9.83,8.5 9.96,8.38 9.96,6.37 9.73,6.15 8.99,6.15 8.23,6.91 v8.08,6.91 7.87,6.7 | v8.45,9.91 8.55,9.8 8.95,9.8 9.68,10.53 9.68,12.42 | v5.05,13.82 5.36,13.82 5.89,13.28 7.88,13.28 8.23,12.93 8.94,12.93 9.07,12.8 9.68,12.8 | 9.68,12.8 9.68,13.64 11.07,15.04 12.19,15.04 12.28,15.12 | 9.68,12.8 9.68,12.42 | 12.28,15.12 P36.P$1 | 12.28,15.12 11.99,15.41 v11.99,18.41 v10.97,18.41
  Bottom 0.152: P36.P$3 P36.P$1 | v5.08,17.27 5.08,17.02 J1.B1
  Bottom 0.203: U1.C4 4.92,11.28 4.22,11.98 4.22,12.39 4.47,12.65 4.62,12.65 4.78,12.8 4.78,13.16 4.62,13.31 4.62,13.51 v4.12,14.01
  Bottom 0.305: J1.B1 5.08,16.26 v5.08,15.65
  other vias: 4.92,10.67 7.37,9.97
  pour Route15 (rank 6): 3.5,7.99 3.74,7.75 4.64,7.75 4.67,7.74 6.64,5.77 12.32,5.77 12.32,19.13 0.89,19.13 0.89,8 3.47,8
AGND  (via drill 0.1)
  Top 0.152: P14.P$3 P14.P$1
  Top 0.203: C12.P$2 1.86,6.42 v1.88,6.4 | 3.87,7.88 U1.M1 3.87,6.94 CX5.2
  Bottom 0.152: P14.P$3 P14.P$1
  other vias: 3.87,7.52 4.57,7.52 4.45,5.44 3.15,3.96 4.5,4.95 4.7,4.45 4.7,3.66 3.94,2.11 5.16,2.14 5.47,1.68 5.47,1 4.17,0.84 3.51,0.77 0.87,0.77 4.4,2.14 3.38,2.11 0.97,2.19 0.76,2.74 1.12,3.15 1.27,3.91 3.17,5.56 1.27,4.57 1.91,5.59 1.68,5.31 1.88,6.05 3.31,2.7 2.67,5.64 3.78,5.56 3.17,5.05 2.62,2.93
  pour Top: 4.64,7.53 4.59,7.58 3.69,7.58 3.66,7.6 3.42,7.84 0.7,7.84 0.7,0.19 2.4,0.19 2.9,0.68 2.93,0.7 5.91,0.7 5.91,1.59 5.34,2.13 5.33,2.13 5.32,2.14 5.31,2.15 5.31,2.15 5.31,2.15 5.3,2.17 5.3,2.18 5.3,2.19 5.3,2.19 5.3,2.2 5.3,2.22 5.3,2.22 5.3,4.16 4.81,4.67 4.8,4.68 4.8,4.68 4.8,4.68 4.79,4.7 4.79,4.71 4.79,4.71 4.79,4.72 4.79,4.73 4.79,6.77 4.65,6.91 4.64,6.94
  pour Route2: 4.64,7.53 4.59,7.58 3.69,7.58 3.66,7.6 3.42,7.84 0.7,7.84 0.7,0.19 2.4,0.19 2.9,0.68 2.93,0.7 5.6,0.7 5.6,1.89 5.31,2.18 5.3,2.22 5.3,4.13 4.8,4.62 4.79,4.66 4.79,6.77 4.65,6.91 4.64,6.94
AP4_!RESET  (via drill 0.1)
  Top 0.152: U1.A6 5.62,11.68 6.23,12.29 6.91,12.29 7.19,12.57 7.19,14.43 8.33,15.57 C4.1 9.44,15.57 | P38.P$3 P38.P$1 | v4.78,17.04 4.78,17.58 4.45,17.91 J1.3 4.86,18.58 5.73,18.58 5.99,18.33 8.08,18.33 SJ1.2 8.08,18.09 9.25,16.92 9.25,16.46 9.54,16.17 9.54,15.57 9.44,15.57 | 9.44,15.57 D1.1 10.06,15.56 v10.06,16.26
  Bottom 0.152: P38.P$1 P38.P$3 11.46,17.66 v10.06,16.26 | J1.B3 4.45,16.64 4.78,16.97 v4.78,17.04
AP4_GP06/TT_FLASH_!HOLD  (via drill 0.1)
  Top 0.152: P24.P$2 P24.P$1
  Route2 0.152: v9.78,3.81 9.65,3.68 9.65,1.8 v10.06,1.4
  Route15 0.152: U1.J5 5.47,8.57 6.02,9.12 6.02,9.42 6.25,9.65 7.21,9.65 8.59,8.28 v8.76,8.28
  Bottom 0.152: P24.P$1 P24.P$2 11.21,0.25 v10.06,1.4 | v8.76,8.28 9.8,7.24 9.8,6.25 9.78,6.22 v9.78,3.81
  other vias: 5.27,8.57
AP4_GP08/TT_9DOF_SCL-COM1  (via drill 0.1)
  Top 0.152: P30.P$3 P30.P$1
  Route15 0.152: v11.56,7.82 11.56,9.27 10.9,9.93 10.39,9.93 v10.36,9.91 | U1.E8 6.88,9.97 7.59,10.69 8.48,10.69 v8.66,10.87
  Bottom 0.152: P30.P$1 P30.P$3 12.73,7.52 11.86,7.52 v11.56,7.82 | v10.36,9.91 9.96,9.91 9.17,10.69 8.84,10.69 v8.66,10.87
  other vias: 6.32,9.97
AP4_GP09/TT_9DOF_SDA-COM0  (via drill 0.1)
  Top 0.152: v10.72,9.02 10.85,9.14 11.66,9.14 11.76,9.04 11.89,9.04 12.16,8.77 P31.P$3 | U1.E7 5.97,9.87 6.02,9.82 6.02,9.12 6.22,8.91 v6.32,8.91
  Top 0.203: P31.P$3 P31.P$1
  Bottom 0.152: v6.32,8.91 6.55,8.91 6.94,9.3 7.17,9.3 7.63,8.84 10.54,8.84 v10.72,9.02
  Bottom 0.203: P31.P$3 P31.P$1
AP4_GP13/TT_9DOF_!BL_PIN  (via drill 0.1)
  Top 0.152: P46.P$2 P46.P$1
  Route15 0.152: U1.D5 5.27,10.55 5.59,10.87 5.59,12.24 4.45,13.39 4.45,16.38 3.69,17.14 P46.P$1
  Bottom 0.152: P46.P$2 P46.P$1
  other vias: 5.27,10.32
AP4_GP14/TT_9DOF_BL_IND  (via drill 0.1)
  Top 0.152: P47.P$2 P47.P$1
  Route15 0.152: v4.12,15.14 4.14,15.16 4.14,16.28 3.15,17.27 3.15,19.2 2.42,19.93 P47.P$1
  Bottom 0.152: U1.D6 5.59,10.35 5.59,11.25 5.36,11.48 5.36,13.95 4.17,15.14 v4.12,15.14 | P47.P$2 P47.P$1
  other vias: 5.62,10.32
AP4_GP17/TT_9DOF_INT  (via drill 0.1)
  Top 0.152: P48.P$2 P48.P$1
  Route2 0.152: U1.D4 4.92,10.22 4.34,9.65 3.45,9.65 3.25,9.86 3.25,10.92 v3.33,11
  Route15 0.152: v3.56,15.14 3.56,15.54 3.83,15.82 3.83,16.18 2.85,17.17 2.85,18.69 2.23,19.3 1.73,19.3 1.15,19.88 P48.P$1
  Bottom 0.152: v3.33,11 3.25,10.92 2.95,10.92 2.72,11.15 2.72,14.2 3.56,15.04 v3.56,15.14 | P48.P$2 P48.P$1
  other vias: 4.92,10.32
AP4_GP18/TT_BATIN  (via drill 0.1)
  Top 0.152: P4.P$2 P4.P$1
  Route15 0.152: U1.D3 4.57,9.88 4.29,9.6 4.09,9.6 3.12,8.64 2.08,8.64 1.83,8.89 1.83,9.45 1.83,13.61 2.01,13.79 v2.01,14.15
  Bottom 0.152: v2.01,14.15 1.09,14.15 0.25,14.99 P4.P$2 P4.P$1
  other vias: 4.57,10.32
AP4_GP24/TT_RFSW_V1  (via drill 0.1)
  Top 0.152: P8.P$2 P8.P$1
  Bottom 0.152: P8.P$1 P8.P$2 0.81,9.48 0.81,8.74 0.86,8.69 3.07,8.69 3.38,8.99 3.38,9.3 4.06,9.97 U1.E2
  other vias: 4.22,9.97
AP4_GP25/TT_RFSW_V2  (via drill 0.1)
  Top 0.152: P9.P$1 P9.P$2 0.81,8.21 0.81,6.07 v0.99,5.89
  Bottom 0.152: P9.P$2 P9.P$1 | U1.K5 5.39,8.22 5.61,8 5.61,7.59 5.69,7.52 5.69,7.01 5.51,6.83 5.26,6.83 5.13,6.96 3.5,6.96 3.4,7.06 1.55,7.06 0.94,6.45 0.94,5.94 v0.99,5.89
  other vias: 5.27,8.22
AP4_GP26/TT_DW_WAKEUP  (via drill 0.1)
  Top 0.152: P34.P$3 P34.P$1
  Route15 0.152: v5.38,7.16 5.33,7.16 5.03,6.86 5.03,6.3 5.18,6.15 5.33,6.15 6.6,4.88 6.6,4.75 6.96,4.39 v6.96,4.27 | v11.38,4.8 10.82,4.8 10.41,5.21 9.02,5.21 8.1,4.29 v8.1,4.22
  Bottom 0.152: P34.P$1 P34.P$3 12.17,12.58 11.63,12.04 11.63,8.97 10.62,7.95 10.62,4.9 10.72,4.8 v11.38,4.8 | U1.L5 5.27,7.28 v5.38,7.16 | v8.1,4.22 8.05,4.27 v6.96,4.27
  other vias: 5.27,7.87
AP4_GP27/TT_DW_IRQ  (via drill 0.1)
  Top 0.152: P35.P$3 P35.P$1 | U1.M5 5.27,7.47 4.72,6.93 v4.72,6.33
  Route15 0.152: v4.72,6.33 4.72,6.17 5,5.89 5.21,5.89 6.3,4.8 6.3,4.52 v6.55,4.27 | v10.77,13.31 10.97,13.51 12.66,13.51 P35.P$1 | v10.41,4.65 10.39,4.65 10.39,4.72 10.16,4.95 9.2,4.95 8.46,4.22 8.46,4.12 8.23,3.89 v8.1,3.89
  Bottom 0.152: P35.P$3 P35.P$1 | v6.55,4.27 6.55,4.24 6.83,3.96 7.85,3.96 7.92,3.89 v8.1,3.89 | v10.77,13.31 11.38,12.7 11.38,9.09 10.36,8.08 10.36,4.72 10.39,4.7 10.39,4.65 v10.41,4.65
AP4_GP29/TT_!DW_SPI_CS  (via drill 0.1)
  Top 0.152: P1.P$2 P1.P$1
  Route15 0.152: v4.06,18.9 3.96,18.8 3.96,17.27 4.75,16.48 4.75,15.47 4.98,15.24 v5.41,15.24
  Bottom 0.152: U1.F4 4.92,9.78 5.15,10.01 5.74,10.01 5.94,10.21 5.94,11.28 5.61,11.61 5.61,15.04 v5.41,15.24 | v4.06,18.9 2.64,18.9 2.23,19.3 0.62,19.3 P1.P$2 P1.P$1
  other vias: 4.92,9.62
AP4_GP30/TT_FLASH_!WP  (via drill 0.1)
  Top 0.152: P23.P$2 P23.P$1
  Route15 0.152: U1.G4 4.92,7.15 4.42,6.66 4.42,5.92 5.26,5.08 5.26,4.98 5.54,4.7 5.69,4.7 6.35,4.04 6.35,3.61
  Route15 0.178: 6.35,3.61 6.25,3.61 arc90 5.38,2.74 5.38,2.64 arc56 5.79,1.88 arc6 v6.3,1.57
  Bottom 0.152: P23.P$1 P23.P$2 9.73,0.25 8.97,1.02 7.32,1.02 6.76,1.57 v6.3,1.57
  other vias: 4.92,9.27
AP4_GP31/TT_DW_SPI_CLK  (via drill 0.1)
  Top 0.152: P12.P$2 P12.P$1
  Bottom 0.152: U1.H2 4.22,8.7 2.84,7.32 1.42,7.32 0.69,6.58 0.69,5.36 0.29,4.96 P12.P$2 P12.P$1
  other vias: 4.22,8.92
AP4_GP32/TT_DW_SPI_IO0  (via drill 0.1)
  Top 0.152: P11.P$2 P11.P$1
  Bottom 0.152: P11.P$1 P11.P$2 0.25,6.52 1.29,7.57 2.72,7.57 3.89,8.74 3.89,9.04 4.12,9.27 U1.G2
  other vias: 4.22,9.27
AP4_GP33/TT_DW_SPI_IO1  (via drill 0.1)
  Top 0.152: P10.P$2 P10.P$1
  Bottom 0.152: U1.G3 4.52,9.32 4.52,9.4 4.32,9.6 4.07,9.6 3.63,9.17 3.63,8.87 3.2,8.43 1.18,8.43 P10.P$2 P10.P$1
  other vias: 4.57,9.27
AP4_GP47/TT_FLASH_SCK  (via drill 0.1)
  Top 0.152: U1.F1 3.83,9.65 3.43,9.65 3.12,9.35 v3.07,9.35 | P7.P$2 P7.P$1
  Bottom 0.152: v3.07,9.35 3.07,9.53 2.01,10.59 0.97,10.59 P7.P$2 P7.P$1
AP4_GP48/TT_FLASH_MOSI  (via drill 0.1)
  Top 0.152: U1.E1 v3.56,9.97 v3.56,9.98 | P6.P$2 P6.P$1
  Bottom 0.152: v3.56,9.98 3.02,9.98 2.13,10.87 1.12,10.87 0.71,11.28 0.71,12.12 P6.P$2 P6.P$1
AP4_GP49/TT_FLASH_MISO  (via drill 0.1)
  Top 0.152: U1.D1 3.57,10.32 v3.56,10.34 | P5.P$2 P5.P$1
  Bottom 0.152: v3.56,10.34 3.07,10.34 2.44,10.97 2.44,12.9 1.52,13.82 0.28,13.82 P5.P$2 P5.P$1
AP4_GP50/TT_!DW_RESET  (via drill 0.1)
  Top 0.152: U1.A9 6.74,11.45 6.74,11.5 7.06,11.82 v7.06,11.96 | P43.P$2 P43.P$1
  Route15 0.152: v7.01,15.85 7.82,16.66 7.82,17.88 7.5,18.2 P43.P$1
  Bottom 0.152: v7.06,11.96 7.06,13.16 6.86,13.36 6.86,15.7 v7.01,15.85 | P43.P$2 P43.P$1
AP4_GP51/LED1_GREEN  (via drill 0.1)
  Top 0.152: R1.2 11.84,15.54 v11.61,15.54 11.58,15.57 11.58,16.97 11.48,17.07 11.48,19.58 P40.P$2 P40.P$1
  Bottom 0.152: U1.B9 6.67,11.14 7.37,11.84 7.37,13.36 7.11,13.61 7.11,13.92 7.32,14.12 9.55,14.12 10.16,14.73 10.16,15.24 10.46,15.54 v11.61,15.54 | P40.P$2 P40.P$1
  other vias: 6.67,11.02
AP4_GP53/LED1_RED  (via drill 0.1)
  Top 0.152: v10.57,15.14 11.1,15.67 R2.2 10.92,15.8 10.52,16.2 10.52,19.48 10.24,19.75 P41.P$2 P41.P$1
  Bottom 0.152: v10.57,15.14 10.57,14.66 10.06,14.15 10.06,13.31 8.99,12.24 8.46,12.24 8.23,12.01 8.23,11.46 7.47,10.7 6.74,10.7 6.71,10.67 U1.C9 | P41.P$2 P41.P$1
  other vias: 6.67,10.67
AP4_GP55/TT_BUZZER_GATE  (via drill 0.1)
  Top 0.152: P33.P$2 P33.P$1
  Route2 0.152: v10.64,11.07 12.52,11.07 P33.P$2 P33.P$1
  Bottom 0.152: P33.P$2 P33.P$1 | v10.64,11.07 10.13,11.58 8.84,11.58 8.74,11.58 7.59,10.44 6.88,10.44 6.79,10.35 6.69,10.35 U1.D9
  other vias: 6.67,10.32
AP4_GP58/TT_!CHG  (via drill 0.1)
  Top 0.152: U1.J7 5.97,8.8 5.74,9.03 5.74,9.14 v5.26,9.63 | P2.P$2 P2.P$1
  Route2 0.152: v5.26,9.63 5.64,10.01 5.74,10.01 5.94,10.21 5.94,11.35 5.02,12.28 v5.02,12.38
  Route15 0.152: v5.02,12.38 4.98,12.38 4.33,13.03 3.83,13.03 3.35,13.51 3.35,14.12 v2.74,14.73
  Bottom 0.152: v2.74,14.73 2.44,15.04 1.42,15.04 0.71,15.75 0.71,17.2 P2.P$2 P2.P$1
AP4_GP60/TT_!PG  (via drill 0.1)
  Top 0.152: P3.P$2 P3.P$1
  Route15 0.152: U1.K8 6.32,8.32 6.11,8.53 5.84,8.53 5.61,8.31 5.61,7.57 5.69,7.49 5.69,7.01 5.33,6.66 v5.33,6.53 | P3.P$1 0.71,15.68 0.71,7.37 1.22,6.86 3.07,6.86 v3.17,6.76
  Bottom 0.152: P3.P$2 P3.P$1 | v5.33,6.53 5.28,6.58 5.11,6.58 4.98,6.71 3.23,6.71 v3.17,6.76
  other vias: 6.32,8.22
AP4_GP63  (via drill 0.1)
  Top 0.152: P25.P$3 P25.P$1 | U1.M6 5.69,7.45 5.69,7.01 5.51,6.83 5.21,6.83 5.03,6.66 5.03,6.17 4.83,5.97 4.83,4.83 5.38,4.27 5.38,2.74 arc67 5.89,1.83 v5.89,1.22
  Route2 0.152: v5.89,1.22 6.17,0.94 9.5,0.94 9.65,1.09 10.05,1.09 10.4,0.74 12.5,0.74 12.91,1.15 P25.P$1
  Bottom 0.152: P25.P$3 P25.P$1
AP4_GP65/TT_9DOF_!RESET  (via drill 0.1)
  Top 0.152: P45.P$3 P45.P$1 | U1.A7 5.97,11.66 6.3,11.99 v6.38,11.99
  Route15 0.152: v5.49,15.65 5.74,15.9 5.74,18.24 4.98,19 4.96,19.02 P45.P$1
  Bottom 0.152: P45.P$3 P45.P$1 | v6.38,11.99 6.38,12.22 6.35,12.24 6.35,14.78 v5.49,15.65
AP4_GP66/TT_QI_TS_CTRL  (via drill 0.1)
  Top 0.152: P44.P$3 P44.P$1 | U1.A8 6.32,11.5 v6.47,11.66 v6.48,11.66
  Bottom 0.152: P44.P$1 P44.P$3 6.23,18.76 6.71,18.29 6.81,18.29 arc-90 7.72,17.37 7.72,17.27 arc-90 6.71,16.26 6.6,16.15 6.6,12.39 6.76,12.24 6.76,11.84 6.58,11.66 v6.48,11.66
AP4_GP69/TT_FLASH_!CS  (via drill 0.1)
  Top 0.152: P42.P$2 P42.P$1
  Route15 0.152: v5.94,14.73 6.76,15.54 7.21,15.54 7.62,15.95 8.03,15.95 8.77,16.7 P42.P$1
  Bottom 0.152: P42.P$2 P42.P$1 | U1.B8 6.32,11.34 5.92,11.73 5.92,14.71 v5.94,14.73
  other vias: 6.32,11.02
AP4_GP72  (via drill 0.1)
  Top 0.152: P39.P$2 P39.P$1
  Route15 0.152: U1.C8 6.19,10.67 5.99,10.87 5.99,12.09 6.3,12.39 8.23,12.39 8.38,12.55 v8.76,12.55 | v9.14,13.26 9.14,18.09 9.99,18.93 P39.P$1
  Bottom 0.152: P39.P$2 P39.P$1 | v8.76,12.55 9.14,12.93 v9.14,13.26
  other vias: 6.32,10.67
AP4_GP79  (via drill 0.1)
  Top 0.152: P22.P$3 P22.P$1
  Route15 0.152: P22.P$1 8.64,0.13 8.64,2.23 8.31,2.56 v8.31,3.07
  Bottom 0.152: P22.P$3 P22.P$1 | U1.M11 7.91,7.52 8.41,7.03 8.41,3.76 8.31,3.66 v8.31,3.07
  other vias: 7.37,7.52
AP4_GP80/SWTRACE0  (via drill 0.1)
  Top 0.152: v8.09,1.42 8.24,1.57 8.24,2.24 7.62,2.88 J2.2 8,3.3 8.46,3.76 8.46,4.06 8.66,4.27 v8.97,4.27
  Bottom 0.152: U1.K10 7.75,8.22 7.88,8.1 8.08,8.1 8.94,7.24 8.94,4.29 v8.97,4.27 | v8.09,1.42 7.62,1.91 J2.B2
  other vias: 7.02,8.22
AP4_GP81/SWTRACE1  (via drill 0.1)
  Top 0.152: v9.04,2.64 9.04,3.25 8.99,3.3 J2.4 8.89,3.81 v8.76,3.93
  Bottom 0.152: U1.L10 7.7,7.87 7.75,7.82 7.98,7.82 8.66,7.14 8.66,4.01 8.74,3.93 v8.76,3.93 | J2.B4 9.04,2.03 v9.04,2.64
  other vias: 7.02,7.87
AP4_GP82/SWTRACE2  (via drill 0.1)
  Top 0.152: J2.6 9.8,3.3 v9.35,2.85 9.55,2.64 9.55,1.83 9.75,1.63 v9.75,0.76 | P18.P$3 P18.P$1
  Route2 0.152: v9.75,0.76 9.68,0.69 4.45,0.69 3.77,0 P18.P$1
  Route15 0.152: v7.72,7.19 7.77,7.24 8.79,7.24 v9.5,6.53
  Bottom 0.152: U1.L9 6.67,7.79 7.26,7.19 v7.72,7.19 | v9.5,6.53 9.5,4.55 9.53,4.52 9.53,4.01 9.47,3.96 9.47,2.97 v9.35,2.85 9.35,2.46 9.78,2.03 J2.B6 | P18.P$3 P18.P$1
  other vias: 6.67,7.87
AP4_GP83/SWTRACE3  (via drill 0.1)
  Top 0.152: v8.61,2.69 8.61,2.31 J2.3 9.35,1.57 9.35,1.12 9.04,0.81 6.12,0.81 5.99,0.69 5.7,0.69 5.26,0.25 P19.P$3 P19.P$1
  Route15 0.152: U1.K9 6.67,9.03 6.88,9.25 7.14,9.25 7.98,8.41 v8,8.41
  Bottom 0.152: v8,8.41 8.18,8.41 9.2,7.39 9.2,4.47 9.27,4.39 9.27,4.14 9.12,3.99 9.12,3.53 J2.B3 8.61,3.02 v8.61,2.69 | P19.P$3 P19.P$1
  other vias: 6.67,8.22
AP4_GP88  (via drill 0.1)
  Top 0.152: P32.P$2 P32.P$1 12.49,10.04 12.3,10.24 v10.92,10.24 | U1.F9 6.6,9.62 6.33,9.35 v6.33,9.25
  Bottom 0.152: P32.P$2 P32.P$1 | v10.92,10.24 10.72,10.03 10.72,9.5 10.31,9.09 7.77,9.09 7.26,9.6 6.58,9.6 6.33,9.35 v6.33,9.25
AP4_LED2_BLUE_COMM
  Top 0.152: R2.1 10.98,16.43 D2.C1
AP4_LED_RED_COMM
  Top 0.152: R1.1 11.98,16.42 D2.C2
AP4_LPADC_VREF
  Top 0.203: U1.A12 7.74,11.37 8.26,11.89 8.26,12.25 7.85,12.65 C11.P$2
AP4_LPMICBIAS  (via drill 0.1)
  Top 0.152: v7.49,13.77 7.49,14.17 C23.P$2
  Bottom 0.152: U1.B10 7.06,11.07 7.06,11.15 7.62,11.71 7.62,13.64 v7.49,13.77
  other vias: 7.02,11.02
AP4_RFIOP
  Top 0.203: U1.M2 4.22,6.32 CX5.1 4.12,6.07 4.12,5.19 L3.1
AP4_SWDCLK  (via drill 0.1)
  Top 0.152: v4.45,17.3 4.45,16.89 J1.4 3.79,16.64 3.5,16.36 v3.5,16.03
  Route15 0.152: U1.K3 3.78,8.22 3.05,7.49 1.65,7.49 1.27,7.87 1.27,14.43 1.75,14.91 2.46,14.91 3.5,15.95 v3.5,16.03
  Bottom 0.152: J1.B4 4.45,17.65 v4.45,17.3
  other vias: 4.57,8.22
AP4_SWDIO  (via drill 0.1)
  Top 0.152: v5.44,17.27 5.44,16.66 J1.2 4.88,16.05 4.01,16.05 3.56,15.6 3.05,15.6 2.29,14.83 v2.29,14.5
  Route15 0.152: U1.J3 4.53,8.53 3.69,8.53 2.93,7.77 1.91,7.77 1.55,8.13 1.55,14.33 1.73,14.5 v2.29,14.5
  Bottom 0.152: J1.B2 5.44,17.88 v5.44,17.27
  other vias: 4.57,8.57
AP4_SWO  (via drill 0.1)
  Top 0.152: v2.52,17.12 2.56,17.12 2.92,16.76 J1.6 2.74,16.46 v2.74,16.03 | U1.L4 v4.56,7.87
  Route15 0.152: v3.38,7.37 3.2,7.19 1.42,7.19 0.99,7.62 0.99,14.53 1.65,15.19 2.36,15.19 2.74,15.57 v2.74,16.03
  Bottom 0.152: v4.56,7.87 4.69,7.87 4.92,7.64 4.92,7.43 4.7,7.21 3.63,7.21 3.48,7.37 v3.38,7.37 | v2.52,17.12 2.92,17.53 J1.B6
AP4_SWTRACECLK  (via drill 0.1)
  Top 0.152: v10.36,8.53 10.36,8.71 10.11,8.97 8.79,8.97 8.21,9.55 7.82,9.55 7.74,9.62 U1.F12 | J2.1 7.62,1.32 7.82,1.12 8.74,1.12 v8.94,1.32
  Route15 0.152: v10.16,4.34 9.68,4.34 9.37,4.04 9.37,3.33 9.65,3.05 9.65,1.93 9.04,1.32 v8.94,1.32
  Bottom 0.152: v10.36,8.53 10.11,8.28 10.11,4.39 v10.16,4.34 | J2.B1 7.62,2.97 8.2,2.39 8.2,1.75 8.64,1.32 v8.94,1.32
AP4_USB0_N  (via drill 0.1)
  Top 0.152: P21.P$2 P21.P$1
  Top 0.178: U1.M8 6.34,7.5 6.34,7.25 6.74,6.86 v6.74,6.84
  Route15 0.178: P21.P$1 7.11,0.39 7.11,0.6 7.76,1.26 7.76,5.82 6.75,6.84 v6.74,6.84
  Bottom 0.152: P21.P$2 P21.P$1
AP4_USB0_P  (via drill 0.1)
  Top 0.152: P20.P$2 P20.P$1
  Top 0.178: U1.M7 5.96,6.94 6.38,6.53 v6.43,6.53
  Route15 0.178: P20.P$1 6.62,0.39 6.62,0.8 7.28,1.46 7.28,5.62 6.43,6.48 v6.43,6.53
  Bottom 0.152: P20.P$2 P20.P$1
AP4_VDDBH
  Top 0.203: U1.G12 7.74,9.25 8.09,9.25 8.71,8.63 9.3,8.63 L2.2 9.97,8.42 10.74,7.65 C25.1 | C25.1 10.26,7.04 10.26,6.43 RZ1.1 | TP1.P$1 11.48,8.26 C25.1
AP4_VDDBH_RF  (via drill 0.1)
  Top 0.203: C12.P$1 3.04,7.62 3.49,8.06 3.49,8.3 3.77,8.58 U1.J1 | RZ1.2 9.58,4.88 8.66,4.88 8.33,4.55 7.9,4.55 7.29,3.94 6.02,3.94 v5.79,4.17
  Top 0.305: v2.41,6.38 C12.P$1
  Bottom 0.305: v5.79,4.17 5.69,4.17 5.59,4.06 4.5,4.06 4.09,4.47 3.15,4.47 2.29,5.33 2.29,6.25 v2.41,6.38
AP4_VDDBH_SW
  Top 0.203: L2.1 9.21,7.12 8.4,7.93 8.4,8.49 7.97,8.92 U1.H12
AP4_VDDC
  Top 0.203: U1.A3 4.57,11.77 4.09,12.24 C17.P$1
AP4_VDDC_LV  (via drill 0.1)
  Top 0.203: v3.07,11.89 2.92,11.89 2.51,12.29 C18.P$1
  Bottom 0.203: U1.B3 4.57,11.18 3.85,11.89 v3.07,11.89
  other vias: 4.57,11.02
AP4_VDDF  (via drill 0.1)
  Top 0.203: C19.P$1 1.83,10.46 2.21,10.85 C22.P$1 | v3.07,11.23 3.02,11.23 2.64,10.85 C22.P$1 | C22.P$1 TP3.P$1
  Bottom 0.203: U1.C2 4.08,10.67 3.66,11.1 3.66,11.13 3.46,11.33 3.17,11.33 v3.07,11.23
  other vias: 4.22,10.67
AP4_VDDMIPI_1P8  (via drill 0.1)
  Top 0.152: P28.P$3 P28.P$1
  Top 0.203: v11.61,6.48 11.91,6.78 RZ4.1 | v9.42,9.73 9.63,9.73 9.88,9.48 C14.P$1 9.98,9.5 9.99,9.5 10.03,9.55 v10.34,9.55
  Route2 0.203: U1.H10 7.02,9.05 7.44,9.47 8.97,9.47 9.22,9.73 v9.42,9.73
  Route15 0.203: P28.P$1 12.92,4.96 12.12,5.77 12.12,5.97 v11.61,6.48 11.71,6.58 11.71,6.96 11.23,7.44 11.23,9.09 10.77,9.55 v10.34,9.55
  Bottom 0.152: P28.P$3 P28.P$1
  other vias: 7.02,8.92
AP4_VDDS
  Top 0.203: U1.C1 3.41,10.67 3.22,10.49 3.22,9.98 2.79,9.55 2.51,9.55 C16.P$1
AP4_VDDUSB_0P9  (via drill 0.1)
  Top 0.152: P26.P$3 P26.P$1
  Top 0.203: v5.99,6.45 6.25,6.2 C24.P$1 6.17,6.07 5.87,5.76 5.87,5.31 6.27,4.9 7.37,4.9 7.65,5.18 7.9,5.18 8.03,5.31 v8.1,5.31 | RZ2.1 12.09,5.08 11.68,5.49 v11.58,5.49
  Route2 0.152: 12.52,2.42 12.27,2.67 10.95,2.67 10.36,3.25 10.36,3.79 arc-70 11.07,4.7 11.07,5.36 11.2,5.49 v11.58,5.49
  Route2 0.203: U1.L7 5.97,7.67 6.09,7.54 6.09,6.55 v5.99,6.45 | P26.P$1 12.52,2.42
  Route15 0.203: v8.1,5.31 8.59,5.79 10.97,5.79 11.28,5.49 v11.58,5.49
  Bottom 0.152: P26.P$3 P26.P$1
  other vias: 5.97,7.87
AP4_VDDUSB_3P3  (via drill 0.1)
  Top 0.152: P27.P$3 P27.P$1
  Top 0.203: v5.66,6.5 5.66,6.24 C13.P$1 5.33,6.07 5.11,5.84 5.11,5.31 5.23,5.18 5.23,4.97 5.6,4.6 7.51,4.6 7.79,4.88 v8.09,4.88 | v11.46,5.16 v11.45,5.16 10.97,5.16 RZ3.1
  Route2 0.203: U1.K7 5.84,8.22 5.61,8 5.61,7.57 5.77,7.42 5.77,6.76 5.66,6.66 v5.66,6.5
  Route15 0.152: 12.52,4.13 12.52,3.73 12.57,3.69
  Route15 0.203: v8.09,4.88 8.14,4.88 8.76,5.49 10.57,5.49 10.9,5.16 v11.46,5.16 11.49,5.16 12.52,4.13 | 12.57,3.69 P27.P$1
  Bottom 0.152: P27.P$3 P27.P$1
  other vias: 5.97,8.22
AP4_XI
  Top 0.152: C3.1 5.67,14.12 X1.2
  Top 0.203: U1.A4 4.92,11.81 5.67,12.56 X1.2
AP4_XI32M
  Top 0.152: 9.45,13.68 9.45,12.39 X2.3 8.87,11.8 8.87,11.62 7.92,10.67 U1.C12
  Top 0.203: 9.45,13.68 CX2.1
AP4_XO
  Top 0.152: 6.42,14.93 6.42,13.56 6.73,13.26
  Top 0.203: U1.A5 5.27,11.73 6.39,12.85 6.52,12.85 X1.1 6.73,13.26 | C2.1 6.42,14.93
AP4_XO32M
  Top 0.152: U1.D12 7.95,10.32 8.19,10.57 9.56,10.57 10.05,11.06 | CX1.1 11,9.73 10.62,10.11 10.62,10.54 10.05,11.11 X2.1
  Top 0.203: 10.05,11.06 X2.1
BLE_RFOUT
  Top 0.203: S4.OUT 0.56,1.56 0.25,1.25 P15.P$3 P15.P$1
  Bottom 0.152: P15.P$3 P15.P$1
GND  (via drill 0.1)
  Top 0.152: P37.P$3 P37.P$1 | P13.P$3 P13.P$1 | X2.4 9.22,11.15 v8.84,11.15 | C11.P$1 8.4,12.97 v8.74,13.31 | v8.74,13.72 8.51,13.72 C15.P$2 | C23.P$1 v8.41,14.91 | C2.2 7.59,15.65 v7.82,15.65 | C4.2 8.43,16.49 8.23,16.28 v7.9,16.28 | v2.85,8.13 3.65,8.93 U1.H1 | v2.85,8.13 | v10.77,14.17 10.41,13.82 CX2.2 | U1.E12 7.97,9.97 8.26,10.26 v8.66,10.26 | J1.5 2.87,17.91 v2.44,17.48 | v9.86,17.37 9.75,17.27 D1.2 | SJ1.1 9.6,17.98 10.13,17.45 v10.13,17.37 | v3.76,13.74 3.87,13.74 C10.P$2 | U1.B12 7.88,11.02 8.59,11.72 v8.59,11.94 | VR2.2 11.03,11.81 v10.74,11.81 | CX1.2 12.27,9.35 v12.27,9.12
  Top 0.203: v4.6,12.22 4.58,12.23 4.58,12.54 C17.P$2 | v2.13,12.71 2.07,12.71 1.86,12.5 C18.P$2 | C13.P$2 5.49,5.39 5.56,5.31 v5.56,5.11 | v6.59,5.77 6.57,5.77 6.33,5.52 C24.P$2 | C9.P$2 7.11,5.82 6.88,5.59 v6.86,5.59 | C8.P$2 8.1,5.82 7.77,5.49 7.52,5.49 7.26,5.23 v6.91,5.23 | C20.P$2 1.86,8.33 2.06,8.13 v2.11,8.13 | C3.2 3.94,14.58 v3.73,14.38 | v2.13,9.83 1.6,9.83 1.15,10.29 C19.P$2 | C7.P$2 1.15,11.3 1.5,10.95 1.85,10.95 2.08,11.18 v2.13,11.18 | v2.11,8.13 1.32,8.13 | v2.85,8.13 v2.11,8.13 | v2.11,8.13 | v12.22,8.13 12.22,7.77 RZ4.2 | C25.2 10.9,6.81 v11.38,6.81 | RZ3.2 11.15,6.2 v11.38,6.2 | RZ2.2 11.41,5.92 v11.38,5.89 | v11.18,14.22 11.18,13.99 C6.P$2 | v12.01,14.22 12.01,14.07 C5.P$2 | v10.26,10.39 10.26,10.33 C14.P$2 | v9.45,9.4 9.12,9.4 C21.P$2 | VR2.2 11.26,11.77 VR2.PAD | X2.2 10.05,12.8 v10.15,12.9 | v9.96,2.64 10.16,2.44 J2.5 | C16.P$2 2.03,9.28 2.03,9.12 v2.13,9.02
  Top 0.305: P13.P$3 0.86,4.3 v0.86,5.11 v1.09,5.33 1.45,5.69 1.45,6.83 1.29,6.99 | 1.32,8.13 1.29,6.99 | 1.29,6.99 1.29,8.71 1.6,9.02 v2.13,9.02 v2.41,9.02
  Route2 0.152: v9.96,2.64 9.96,3.5 10.08,3.63 10.08,3.94 9.42,4.6 8.43,4.6 8.36,4.52 7.85,4.52 v6.93,3.61
  Route2 0.203: U1.J10 7.37,8.57 7.66,8.87 8.53,8.87
  Route2 0.305: 4.3,12.61 4.31,12.61 4.54,12.85 6.94,12.85
  Route2 0.406: P37.P$1 11.62,16.39 11.58,16.36
  Bottom 0.152: P37.P$3 P37.P$1 | P13.P$3 P13.P$1 | J1.B5 3.1,16.46 v3.1,16.03
  Bottom 0.203: J2.B5 9.96,3.1 v9.96,2.64
  Bottom 0.305: v1.09,5.33 3.25,3.17 5.28,3.17 5.82,3.71 6.6,3.71 6.71,3.61 v6.93,3.61
  Bottom 0.406: P37.P$3 11.62,16.39 11.58,16.36
  Bottom 0.61: P13.P$3 0.95,3.69 1.02,3.76
  other vias: 6.32,7.87 7.02,8.57 4.22,10.32 4.22,11.02 5.27,11.02 3.87,7.87 4.22,7.87 10.62,12.9 0.86,4.78 6.45,1.24
  pour Route2 (rank 6): 0.89,0.89 12.32,0.89 12.32,19.13 0.89,19.13
  pour Bottom (rank 6): 2.86,3.44 3.18,3.12 6.11,3.12 6.14,3.11 6.16,3.09 6.17,3.06 6.17,0.89 12.32,0.89 12.32,19.13 0.69,19.13 0.69,3.45 2.83,3.45
N$17
  Top 0.203: L3.2 4.78,3.04 4.78,2.87 C1.1 4.78,2.72 4.78,1.65 L4.1
N$18
  Top 0.203: L4.2 3.9,1.56 S4.IN
SIMOBUCK_SW
  Top 0.203: U1.A1 3.87,11.58 2.74,12.7 2.66,12.7 1.64,13.72 L1.P$1
SIMOBUCK_SWSEL
  Top 0.203: U1.A2 4.22,11.67 3.03,12.85 L1.P$2
VDD  (via drill 0.1)
  Top 0.152: RZ5.1 11.07,10.85 v11.07,11.38
  Top 0.203: P29.P$3 P29.P$1 | VR2.4 12.24,12.57 12.24,13.29 C5.P$1 11.92,13.34 v11.63,13.06
  Route15 0.203: P29.P$1 12.97,6.23 11.89,7.32 11.89,9.75 11.07,10.57 v11.07,11.38 11.07,12.5 v11.63,13.06
  Bottom 0.203: P29.P$3 P29.P$1
VDDAUDA_1P8-CLEAN  (via drill 0.1)
  Top 0.203: v7.92,12.06 7.9,12.06 7.52,12.45 7.52,13.28 C15.P$1 7.85,13.85 8.13,14.12 8.64,14.12 8.94,14.43 10.54,14.43 10.95,14.83 RZ6.2
  Bottom 0.203: v7.92,12.06 7.92,12.04 7.92,11.58 U1.B11
  other vias: 7.37,11.02
VR2_EN
  Top 0.152: RZ5.2 12.22,10.97 12.22,11.63 VR2.3
VR2_OUT
  Top 0.203: RZ6.1 12.02,14.73 11.66,14.38 11.66,13.62 11.38,13.34 C6.P$1 11.28,12.62 VR2.1
(copper drawn outside any net)
  shapes: Bottom area x7, Route15 area x6, Route2 area x8

### Text on the board
tPlace: prog | r eset | SWD | B | trace | Pat Pannuto | AP4BP | 2023-06
tDocu: Fabrication Notes | Designed for CircuitHub Std Fab: 4-Layer, 0.6mm / / Order Name Matrl Dscrpt Dielec Thk(mm) CuWgt(oz) / 1: Top Copper Signal 0.035 1oz / 2116 Prepreg 4.5 0.12 / 2: Route2 Copper Ground 0.035 1oz / FR4 Core 4.6 0.23 / 3: Route15 Copper Pwr/Gnd 0.12 1oz / 2116 Prepreg 4.5 0.12 / 4: Bottom Copper Sig/Gnd 0.035 1oz | Stackup: | Impedence Control | One 50Ω trace for 2.4 GHz (Bluetooth) / - Routed as coplanar wave, params: / - Conductor Width = 8 mil / - Conductor Height = 4.725 mil [0.12mm] / - Er=4.5 / - Modeled Z ~= 50.1 Ω / / Trace U1-L3-L4-S4-P15(Castellation) | AGND/GND / Connection
bDocu: XXX IGNORE FOR REV-K ; UNUSED XXX / / One 90Ω differential pair USB PHY / - Routed as edge-coupled external / - Conductor Width = 6 mil / - Conductor Spacing = 12 mil / - Conductor Height = 4.725 mil [0.12mm] / - Er=4.5 / - Modeled Zdiff ~= 90.05 Ω / / Traces U1-P20,P21(Castellations) / / XXX IGNORE FOR REV-K ; UNUSED XXX